# EAGLE design 612_jetracer_esp32s3_030003 (EAGLE 9.6.2)
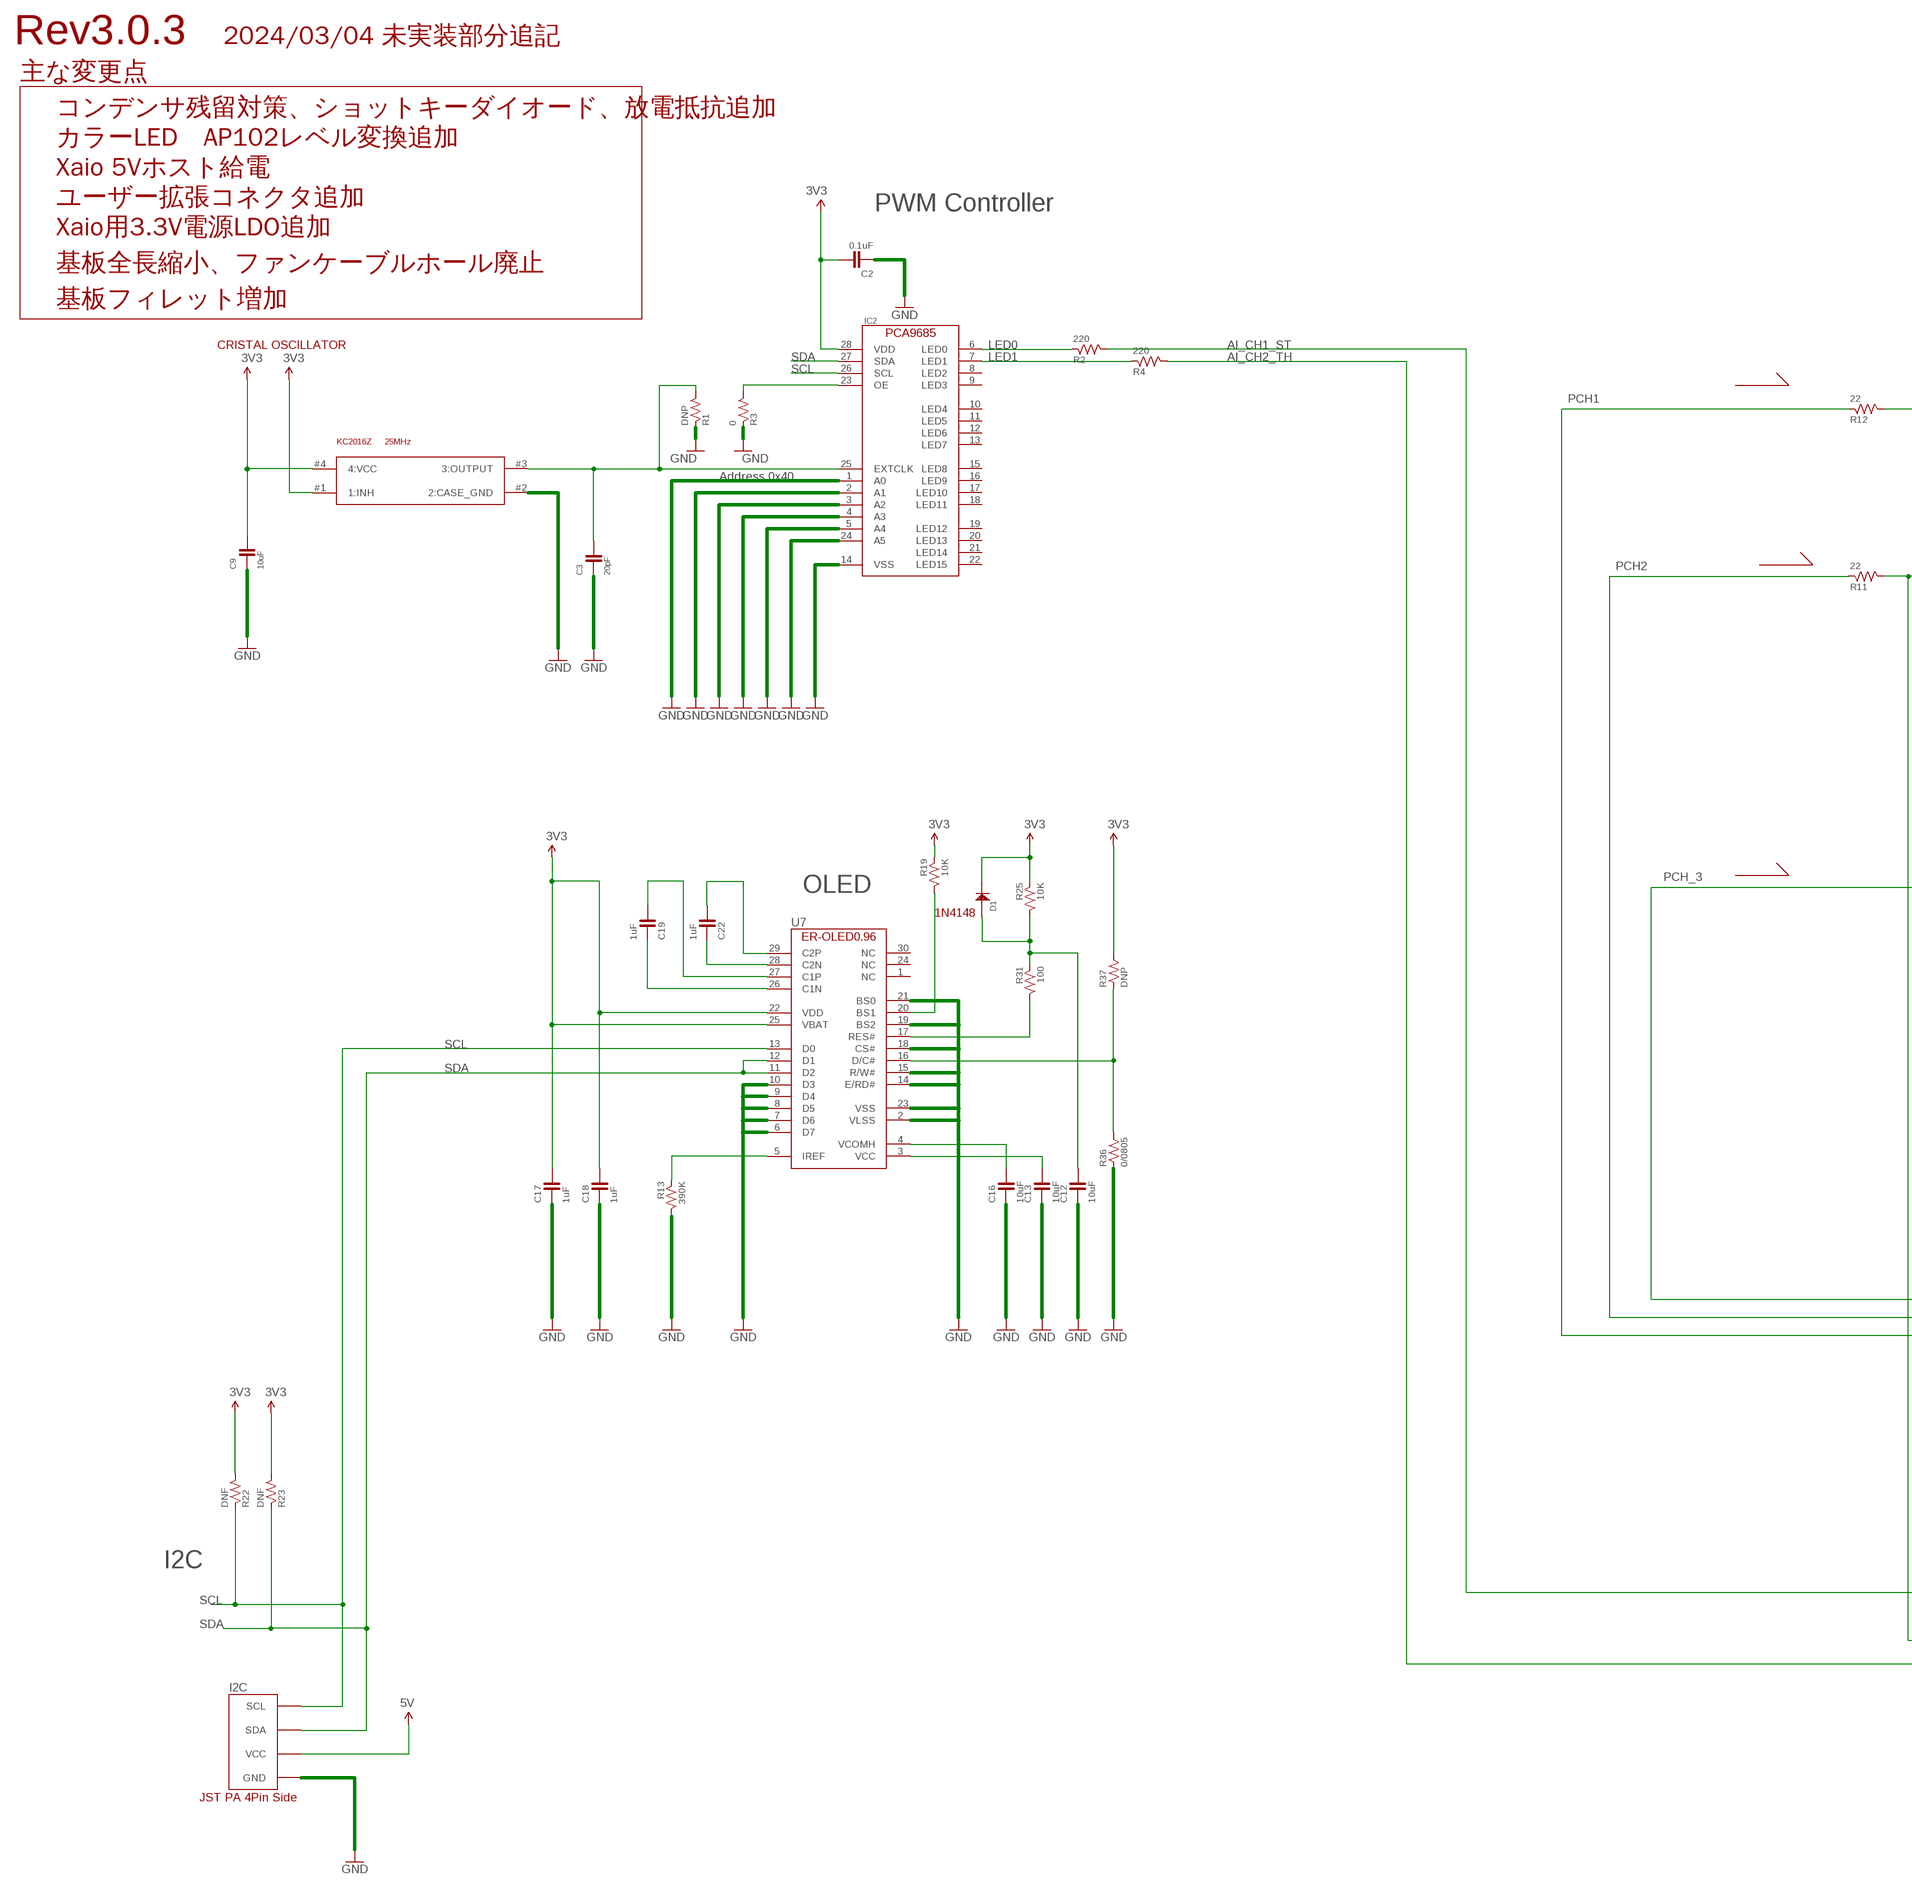
[diagram p0: schematic, sheet 1, part 1 of 3]
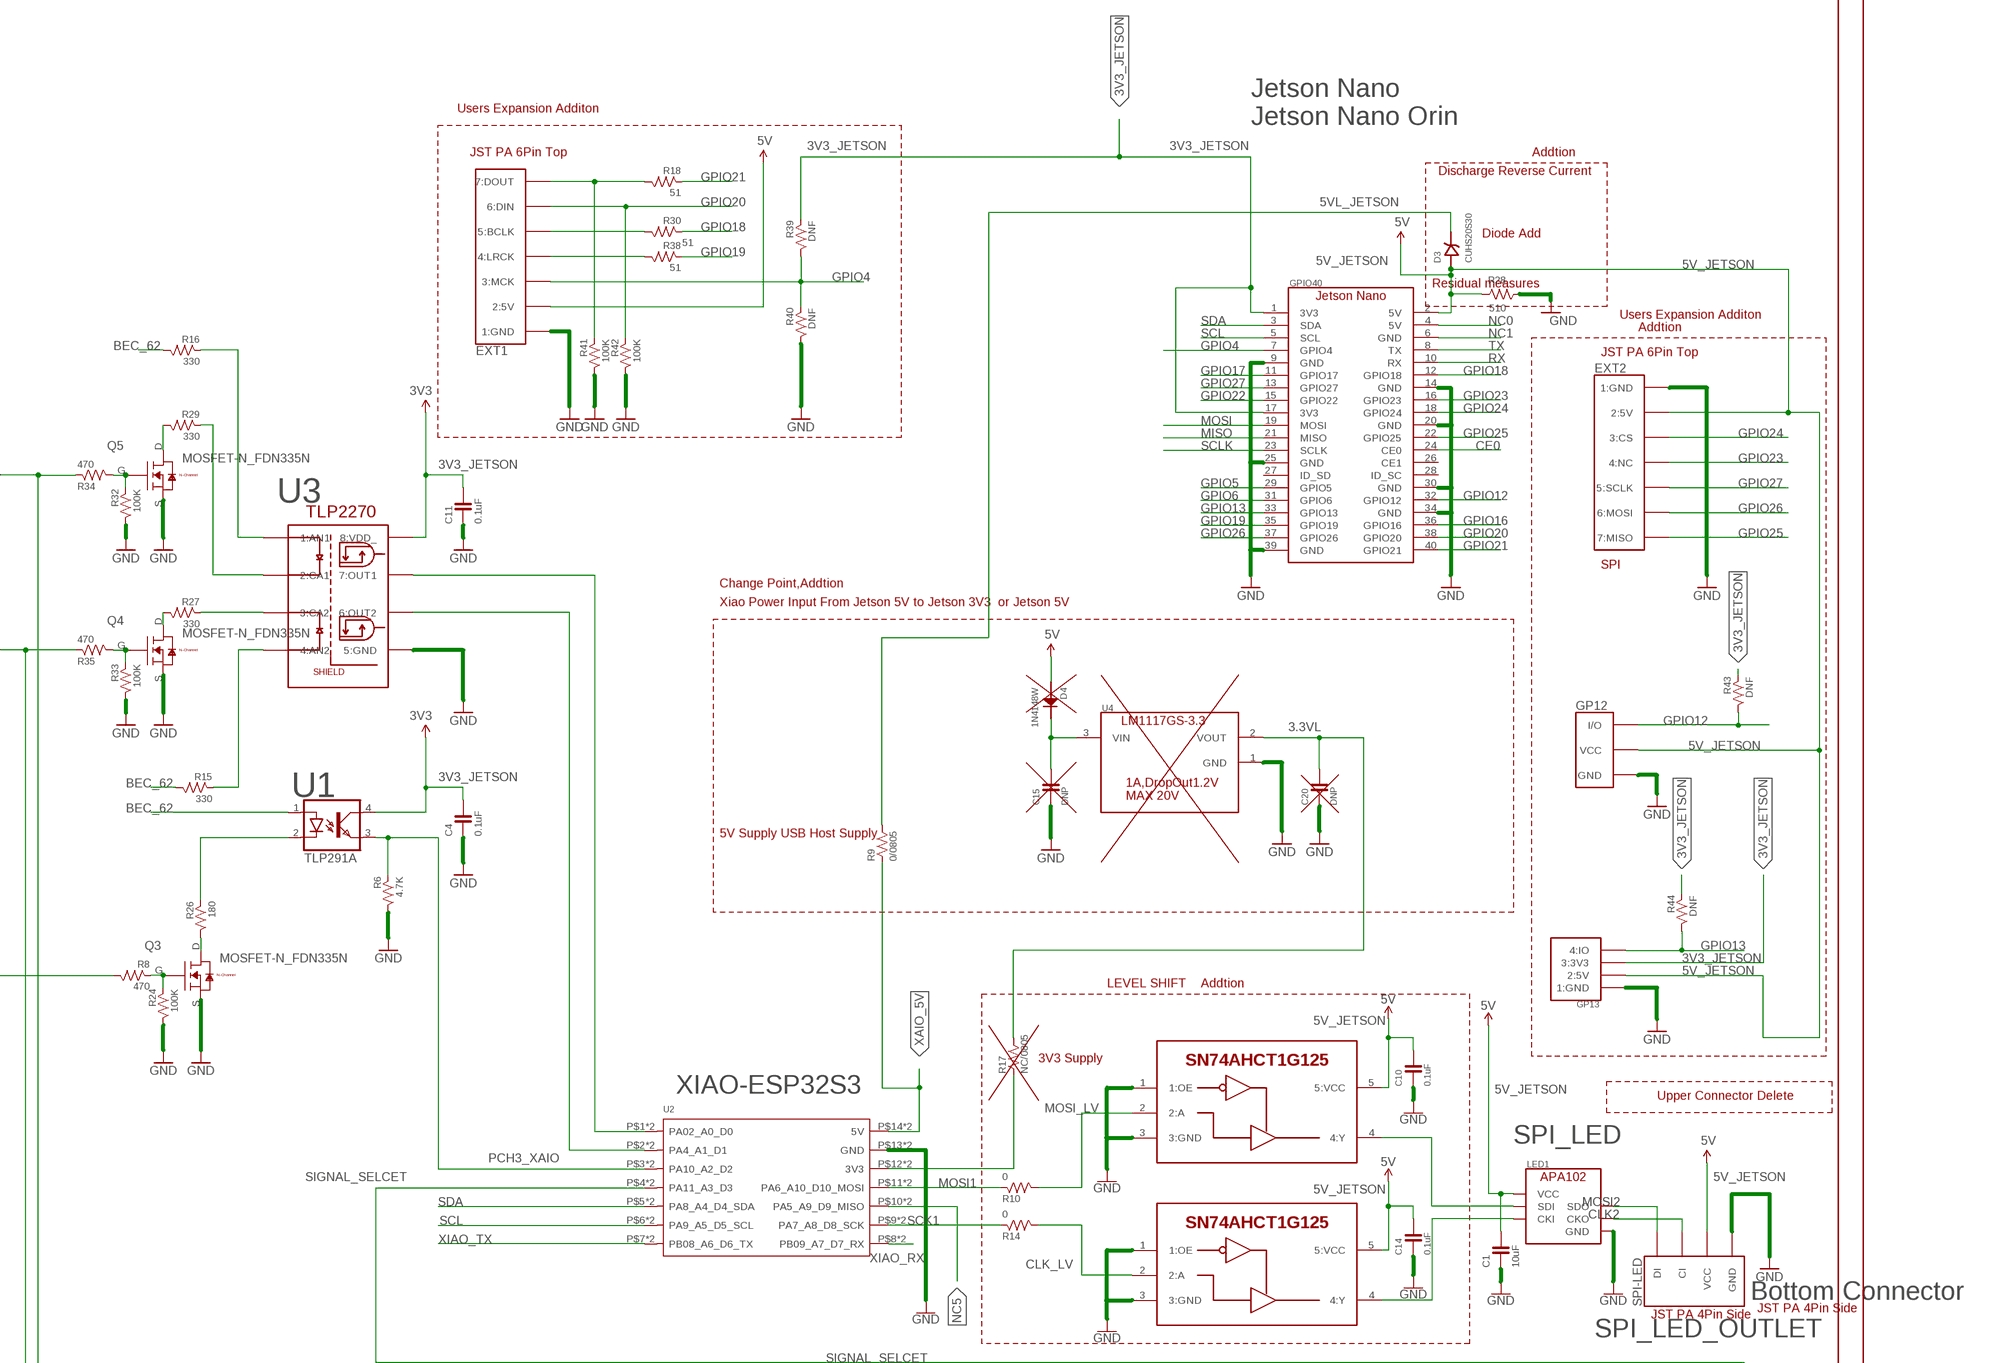
[diagram p1: schematic, sheet 1, part 2 of 3]
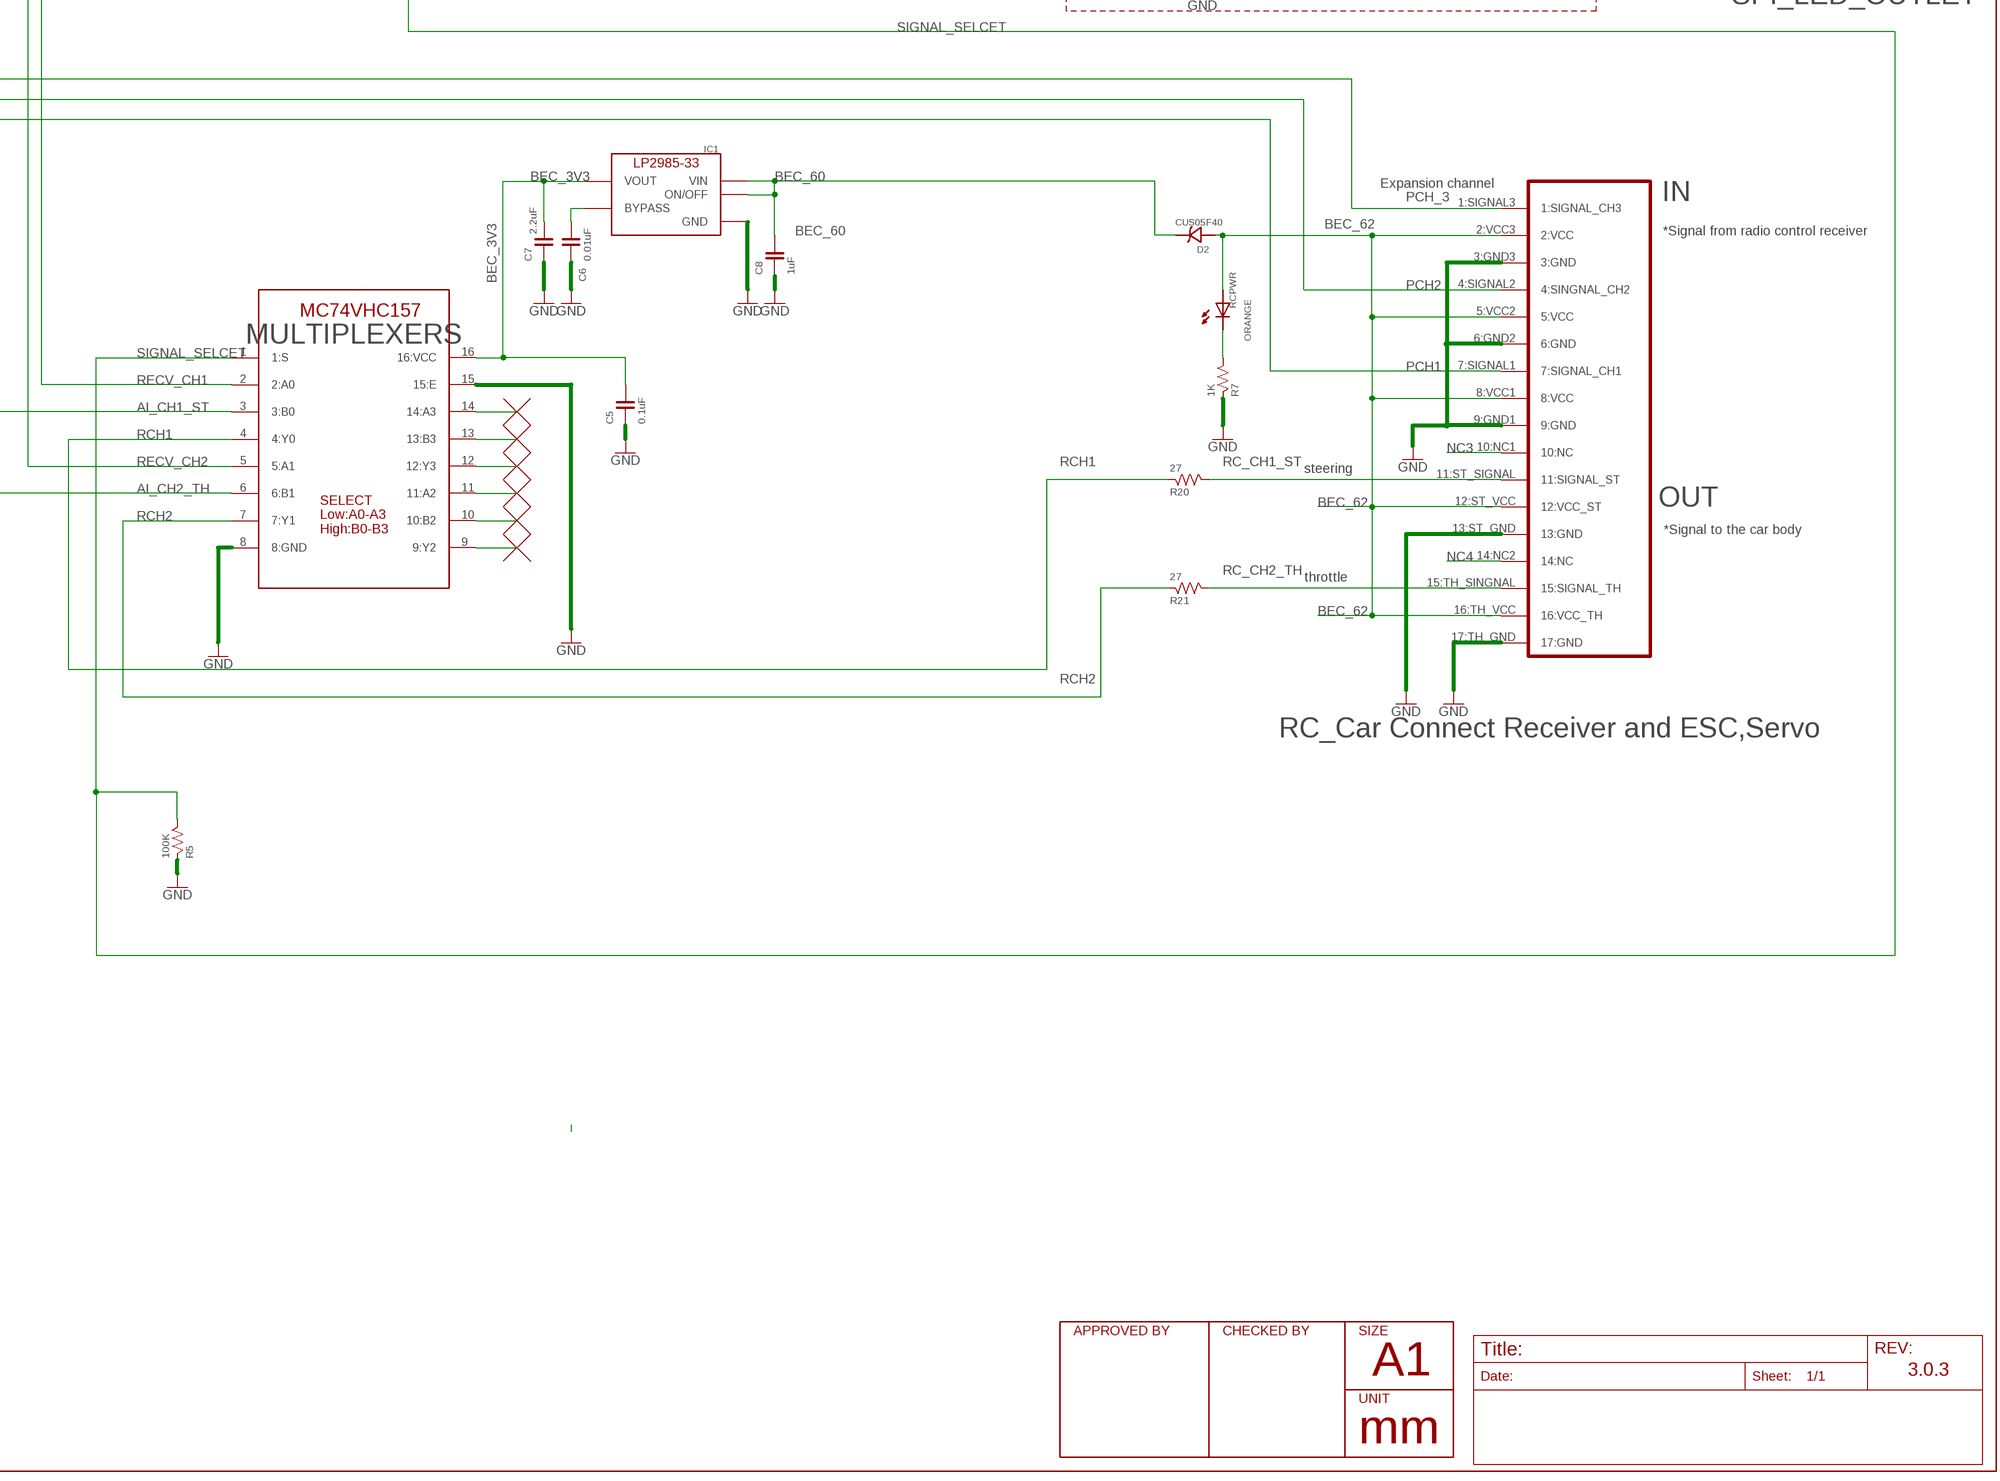
[diagram p2: schematic, sheet 1, part 3 of 3]

## Parts
C1  10uF  CAPACITOR-0603  [0603]
C2  0.1uF  CAPACITOR-0603  [0603]
C3  20pF  CAPACITOR-0402  [0402]
C4  0.1uF  CAPACITOR-0603  [0603]
C5  0.1uF  CAPACITOR-0603  [0603]
C6  0.01uF  CAPACITOR-0603  [0603]
C7  2.2uF  CAPACITOR-0603  [0603]
C8  1uF  CAPACITOR-0603  [0603]
C9  10uF  CAPACITOR-0402  [0402]
C10  0.1uF  CAPACITOR-0402  [0402]
C11  0.1uF  CAPACITOR-0603  [0603]
C12  10uF  CAPACITOR-0603  [0603]
C13  10uF  CAPACITOR-0603  [0603]
C14  0.1uF  CAPACITOR-0402  [0402]
C15  DNP  CAPACITOR-0402  [0402]
C16  10uF  CAPACITOR-0603  [0603]
C17  1uF  CAPACITOR-0603  [0603]
C18  1uF  CAPACITOR-0603  [0603]
C19  1uF  CAPACITOR-0603  [0603]
C20  DNP  CAPACITOR-0402  [0402]
C22  1uF  CAPACITOR-0603  [0603]
D1  1N4148  [1N4148W]
D2  CUS05F40  [CUS05F40]
D3  CUHS20S30  [US2H]
D4  1N4148W  [SOD-123]
EXT1  FABO-I2S-7PIN  [SPI-B07B-PASK-1]
EXT2  FABO-SPI-7PIN  [SPI-B07B-PASK-1]
GP12  FABO_BRICK_3PIN-B03B-PASK-1  [FABO_BRICK_3PIN_B03B-PASK-1]
GP13  FABO-GPIO-2G  [GPIO-B04B-PASK-1]
GPIO40  JETSON_NANOJETSON_NANO_OVERALL  [JETSON_NANO_DEMENTION]
I2C  FABO-I2C  [I2C-SM04B-PASS-1-FL]
IC1  LP2985-33DBVR  [SOT-23-5]
IC2  PCA9685PW,BS  [PCA9685]
LED1  APA102_IPIXEL  [APA102_2020]
Q3  MOSFET-N_FDN335N  [SUPERSOT-3]
Q4  MOSFET-N_FDN335N  [SUPERSOT-3]
Q5  MOSFET-N_FDN335N  [SUPERSOT-3]
R1  DNP  RESISTOR-0603  [0603]
R2  220  RESISTOR-0603  [0603]
R3  0  RESISTOR-0603  [0603]
R4  220  RESISTOR-0603  [0603]
R5  100K  RESISTOR-0603  [0603]
R6  4.7K  RESISTOR-0603  [0603]
R7  1K  RESISTOR-0603  [0603]
R8  470  RESISTOR-0603  [0603]
R9  0/0805  RESISTOR-0805  [0805]
R10  0  RESISTOR-0603  [0603]
R11  22  RESISTOR-0603  [0603]
R12  22  RESISTOR-0603  [0603]
R13  390K  RESISTOR-0603  [0603]
R14  0  RESISTOR-0603  [0603]
R15  330  RESISTOR-0603  [0603]
R16  330  RESISTOR-0603  [0603]
R17  NC/0805  RESISTOR-0805  [0805]
R18  51  RESISTOR-0603  [0603]
R19  10K  RESISTOR-0603  [0603]
R20  27  RESISTOR-0603  [0603]
R21  27  RESISTOR-0603  [0603]
R22  DNF  RESISTOR-0603  [0603]
R23  DNF  RESISTOR-0603  [0603]
R24  100K  RESISTOR-0603  [0603]
R25  10K  RESISTOR-0603  [0603]
R26  180  RESISTOR-0603  [0603]
R27  330  RESISTOR-0603  [0603]
R28  510  RESISTOR-0805  [0805]
R29  330  RESISTOR-0603  [0603]
R30  51  RESISTOR-0603  [0603]
R31  100  RESISTOR-0603  [0603]
R32  100K  RESISTOR-0603  [0603]
R33  100K  RESISTOR-0603  [0603]
R34  470  RESISTOR-0603  [0603]
R35  470  RESISTOR-0603  [0603]
R36  0/0805  RESISTOR-0805  [0805]
R37  DNP  RESISTOR-0805  [0805]
R38  51  RESISTOR-0603  [0603]
R39  DNF  RESISTOR-0603  [0603]
R40  DNF  RESISTOR-0603  [0603]
R41  100K  RESISTOR-0603  [0603]
R42  100K  RESISTOR-0603  [0603]
R43  DNF  RESISTOR-0603  [0603]
R44  DNF  RESISTOR-0603  [0603]
RCPWR  ORANGE  LED-0603  [0603]
SPI-LED  FABO-SPI-LED  [SPI-SM04B-PASS-1-FL]
U1  TLP291A  [11-3C1]
U2  MOUDLE-SEEEDUINO-XIAO-ESP32C3  [MOUDLE14P-DIP]
U3  TLP2270  [TLP2270]
U4  LM1117GS-3.3  [SOT-223-3]
U7  ER-OLED0.96-1ER-CON30HT-1  [ER-CON30HT-1]
U$1  RC_17PIN_OUTIN  [PNHEADER_2.54_SMT_17PIN_RC_TT01_02]
U$3  MC74VHC157  [MC74VHC157_TSSOP-16]
U$9  SN74AHCT1G125  [SOT-1DOT1]
U$10  SN74AHCT1G125  [SOT-1DOT1]
U$11  KC2016Z  [KC2016Z]

## Nets
3.3VL: C20.2 R17.2 U4.2(VOUT)
3V3_JETSON: C2.2 C4.2 C9.2 C11.2 C17.2 C18.2 D1.CATHODE GP13.3V3(3:3V3) GPIO40.1(3V3) GPIO40.17(3V3) IC2.28(VDD) R19.1 R22.2 R23.2 R25.1 R37.2 R39.1 R43.1 R44.1 U1.4(COL) U3.8(8:VDD_) U7.22(VDD) U7.25(VBAT) U$11.#1(1:INH) U$11.#4(4:VCC) ; supply symbol labelled 3V3
3VLL: R17.1 U2.P$12(3V3) U2.P$26(3V3)
5V_JETSON: C1.2 C10.2 C14.2 D3.A(ANODE) D4.2(ANODE) EXT1.2(2:5V) EXT2.2(2:5V) GP12.VCC GP13.5V(2:5V) GPIO40.2(5V) I2C.5V(VCC) LED1.VCC R28.2 SPI-LED.5V(VCC) U$9.5(5:VCC) U$10.5(5:VCC) ; supply symbol labelled 5V
5VL_JETSON: D3.K(CATHODE) R9.2
AI_CH1_ST: R2.2 U$3.3(3:B0)
AI_CH2_TH: R4.2 U$3.6(6:B1)
BEC_3V3: C5.2 C7.2 IC1.5(VOUT) U$3.16(16:VCC)
BEC_60: C8.2 D2.C(CATHODE) IC1.1(VIN) IC1.3(ON/OFF)
BEC_62: D2.A(ANODE) R15.2 R16.2 RCPWR.ANODE U1.1(A) U$1.2:VCC3(2:VCC) U$1.5:VCC2(5:VCC) U$1.8:VCC1(8:VCC) U$1.12:ST_VCC(12:VCC_ST) U$1.16:TH_VCC(16:VCC_TH)
CE0: GPIO40.24(CE0)
CLK2: LED1.CKO SPI-LED.CI
CLK_HV: LED1.CKI U$10.4(4:Y)
CLK_LV: R14.2 U$10.2(2:A)
G18: EXT1.5(5:BCLK) R30.2
G19: EXT1.4(4:LRCK) R38.2
G21: EXT1.7(7:DOUT) R18.2 R41.1
GND: C1.1 C2.1 C3.1 C4.1 C5.1 C6.1 C7.1 C8.1 C9.1 C10.1 C11.1 C12.1 C13.1 C14.1 C15.1 C16.1 C17.1 C18.1 C20.1 EXT1.1(1:GND) EXT2.1(1:GND) GP12.GND GP13.GND(1:GND) GPIO40.9(GND) GPIO40.14(GND) GPIO40.20(GND) GPIO40.25(GND) GPIO40.30(GND) GPIO40.34(GND) GPIO40.39(GND) I2C.GND IC1.2(GND) IC2.1(A0) IC2.2(A1) IC2.3(A2) IC2.4(A3) IC2.5(A4) IC2.14(VSS) IC2.24(A5) LED1.GND Q3.S Q4.S Q5.S R1.1 R3.1 R5.1 R6.2 R7.1 R13.2 R24.2 R28.1 R32.2 R33.2 R36.1 R40.2 R41.2 R42.2 SPI-LED.GND U2.P$13(GND) U2.P$27(GND) U3.5(5:GND) U4.1(GND) U7.2(VLSS) U7.6(D7) U7.7(D6) U7.8(D5) U7.9(D4) U7.10(D3) U7.14(E/RD#) U7.15(R/W#) U7.18(CS#) U7.19(BS2) U7.21(BS0) U7.23(VSS) U$1.3:GND3(3:GND) U$1.6:GND2(6:GND) U$1.9:GND1(9:GND) U$1.13:ST_GND(13:GND) U$1.17:TH_GND(17:GND) U$3.8(8:GND) U$3.15(15:E) U$9.1(1:OE) U$9.3(3:GND) U$10.1(1:OE) U$10.3(3:GND) U$11.#2(2:CASE_GND)
GPIO4: EXT1.3(3:MCK) GPIO40.7(GPIO4) R39.2 R40.1
GPIO5: GPIO40.29(GPIO5)
GPIO6: GPIO40.31(GPIO6)
GPIO12: GP12.I/O GPIO40.32(GPIO12) R43.2
GPIO13: GP13.IO(4:IO) GPIO40.33(GPIO13) R44.2
GPIO16: GPIO40.36(GPIO16)
GPIO17: GPIO40.11(GPIO17)
GPIO18: GPIO40.12(GPIO18) R30.1
GPIO19: GPIO40.35(GPIO19) R38.1
GPIO20: EXT1.6(6:DIN) GPIO40.38(GPIO20) R42.1
GPIO21: GPIO40.40(GPIO21) R18.1
GPIO22: GPIO40.15(GPIO22)
GPIO23: EXT2.4(4:NC) GPIO40.16(GPIO23)
GPIO24: EXT2.3(3:CS) GPIO40.18(GPIO24)
GPIO25: EXT2.7(7:MISO) GPIO40.22(GPIO25)
GPIO26: EXT2.6(6:MOSI) GPIO40.37(GPIO26)
GPIO27: EXT2.5(5:SCLK) GPIO40.13(GPIO27)
LED0: IC2.6(LED0) R2.1
LED1: IC2.7(LED1) R4.1
MISO: GPIO40.21(MISO)
MOSI: GPIO40.19(MOSI)
MOSI1: R10.1 U2.P$11(PA6_A10_D10_MOSI) U2.P$25(PA6_A10_D10_MOSI)
MOSI2: LED1.SDO SPI-LED.DI
MOSI_HV: LED1.SDI U$9.4(4:Y)
MOSI_LV: R10.2 U$9.2(2:A)
N$2: U$3.9(9:Y2)
N$3: C22.2 U7.29(C2P)
N$4: U$3.10(10:B2)
N$5: U2.P$1(PA02_A0_D0) U2.P$15(PA02_A0_D0) U3.7(7:OUT1)
N$6: R26.1 U1.2(C)
N$7: IC2.23(OE) R3.2
N$8: U2.P$2(PA4_A1_D1) U2.P$16(PA4_A1_D1) U3.6(6:OUT2)
N$9: R15.1 U3.4(4:AN2)
N$10: C15.2 D4.1(CATHODE) U4.3(VIN)
N$12: R16.1 U3.1(1:AN1)
N$14: R13.1 U7.5(IREF)
N$16: C19.2 U7.27(C1P)
N$17: C13.2 U7.3(VCC)
N$18: R31.2 U7.17(RES#)
N$19: U$3.11(11:A2)
N$20: U$3.12(12:Y3)
N$21: C19.1 U7.26(C1N)
N$22: C22.1 U7.28(C2N)
N$23: Q3.G R8.1 R24.1
N$24: R7.2 RCPWR.CATHODE
N$25: C16.2 U7.4(VCOMH)
N$26: Q3.D R26.2
N$27: Q4.D R27.2
N$28: R27.1 U3.3(3:CA2)
N$29: Q5.D R29.2
N$30: R29.1 U3.2(2:CA1)
N$31: U$3.13(13:B3)
N$32: C12.2 D1.ANODE R25.2 R31.1
N$33: Q5.G R32.1 R34.2
N$35: U$3.14(14:A3)
N$37: R36.2 R37.1 U7.16(D/C#)
N$38: Q4.G R33.1 R35.2
N$40: C6.2 IC1.4(BYPASS)
N$41: C3.2 IC2.25(EXTCLK) R1.2 U$11.#3(3:OUTPUT)
N$50: R19.2 U7.20(BS1)
NC0: GPIO40.4(5V)
NC1: GPIO40.6(GND)
NC3: U$1.10:NC1(10:NC)
NC4: U$1.14:NC2(14:NC)
NC5: U2.P$10(PA5_A9_D9_MISO) U2.P$24(PA5_A9_D9_MISO)
PCH1: R12.1 U$1.7:SIGNAL1(7:SIGNAL_CH1)
PCH2: R11.1 U$1.4:SIGNAL2(4:SINGNAL_CH2)
PCH3_XAIO: R6.1 U1.3(EMI) U2.P$3(PA10_A2_D2) U2.P$17(PA10_A2_D2)
PCH_3: R8.2 U$1.1:SIGNAL3(1:SIGNAL_CH3)
RC_CH1_ST: R20.2 U$1.11:ST_SIGNAL(11:SIGNAL_ST)
RC_CH2_TH: R21.2 U$1.15:TH_SINGNAL(15:SIGNAL_TH)
RCH1: R20.1 U$3.4(4:Y0)
RCH2: R21.1 U$3.7(7:Y1)
RECV_CH1: R12.2 R34.1 U$3.2(2:A0)
RECV_CH2: R11.2 R35.1 U$3.5(5:A1)
RX: GPIO40.10(RX)
SCK1: R14.1 U2.P$9(PA7_A8_D8_SCK) U2.P$23(PA7_A8_D8_SCK)
SCL: GPIO40.5(SCL) I2C.SCL IC2.26(SCL) R22.1 U2.P$6(PA9_A5_D5_SCL) U2.P$20(PA9_A5_D5_SCL) U7.13(D0)
SCLK: GPIO40.23(SCLK)
SDA: GPIO40.3(SDA) I2C.SDA IC2.27(SDA) R23.1 U2.P$5(PA8_A4_D4_SDA) U2.P$19(PA8_A4_D4_SDA) U7.11(D2) U7.12(D1)
SIGNAL_SELCET: R5.2 U2.P$4(PA11_A3_D3) U2.P$18(PA11_A3_D3) U$3.1(1:S)
TX: GPIO40.8(TX)
XAIO_5V: R9.1 U2.P$14(5V) U2.P$28(5V)
XIAO_RX: U2.P$8(PB09_A7_D7_RX) U2.P$22(PB09_A7_D7_RX)
XIAO_TX: U2.P$7(PB08_A6_D6_TX) U2.P$21(PB08_A6_D6_TX)
Unconnected: GPIO40.26(CE1) GPIO40.27(ID_SD) GPIO40.28(ID_SC) IC2.8(LED2) IC2.9(LED3) IC2.10(LED4) IC2.11(LED5) IC2.12(LED6) IC2.13(LED7) IC2.15(LED8) IC2.16(LED9) IC2.17(LED10) IC2.18(LED11) IC2.19(LED12) IC2.20(LED13) IC2.21(LED14) IC2.22(LED15) U7.1(NC) U7.24(NC) U7.30(NC)

## Notes on the sheet
- Rev3.0.3 | 2024/03/04 未実装部分追記
- Users Expansion Additon
- Jetson Nano
  Jetson Nano Orin
- 主な変更点
- JST PA 6Pin Top | Addtion
- コンデンサ残留対策、ショットキーダイオード、放電抵抗追加
- Discharge Reverse Current
- カラーLED　AP102レベル変換追加
- Xaio 5Vホスト給電
- Diode Add
- ユーザー拡張コネクタ追加 | PWM Controller
- Residual measures
- Xaio用3.3V電源LDO追加
- Users Expansion Additon
- 基板全長縮小、ファンケーブルホール廃止 | Addtion
- JST PA 6Pin Top
- 基板フィレット増加
- CRISTAL OSCILLATOR
- Address 0x40
- SPI
- Change Point,Addtion
- Xiao Power Input From Jetson 5V to Jetson 3V3  or Jetson 5V
- 5V Supply USB Host Supply
- OLED
- LEVEL SHIFT | Addtion
- 1N4148
- 3V3 Supply
- XIAO-ESP32S3
- Upper Connector Delete
- SPI_LED
- Bottom Connector
- JST PA 4Pin Side
- JST PA 4Pin Side
- SPI_LED_OUTLET
- Expansion channel
- IN
- *Signal from radio control receiver
- MULTIPLEXERS
- I2C
- steering
- OUT
- *Signal to the car body
- SELECT
  Low:A0-A3
  High:B0-B3
- throttle
- JST PA 4Pin Side
- RC_Car Connect Receiver and ESC,Servo
- 3.0.3

## Library data of the parts
C1-C20 C22 = FaBo-Capacitor:CAPACITOR: CAPACITOR
D1 = FaBo-Diode:1N4148
D2 = FaBo-Diode:CUS05F40
D3 = FaBo-Diode:CUHS20S30: 30V,2A,temp-50~150,if 0.25V(0.5A),rev 170uA(10V)
D4 = FaBo-Diode:1N4148W
EXT1 = FaBo-Connetor:FABO-I2S-7PIN
EXT2 = FaBo-Connetor:FABO-SPI-7PIN
GP12 = FaBo-Template:FABO_BRICK_3PIN: FaBo Brick 3pin
GP13 = FaBo-Connetor:FABO-GPIO-2G
GPIO40 = FaBo-Boards:JETSON_NANO
I2C = FaBo-Connetor:FABO-I2C
IC1 = FaBo-Supply:LP2985-33DBVR: LP2985
IC2 = FaBo-Motor:PCA9685PW,BS
LED1 = FaBo-LED:APA102
Q3-Q5 = FaBo-Mosfet:MOSFET-N
R1-R36 R38-R44 = FaBo-Resistors:RESISTOR: RESISTOR
R37 = FaBo-Resistors:RESISTOR: RESISTOR; SPICEPREFIX: R
RCPWR = FaBo-LED:LED
SPI-LED = FaBo-Connetor:FABO-SPI-LED
U1 = FaBo_Photocoupler:TLP291A
U2 = FaBo-MPU:MOUDLE-SEEEDUINO-XIAO-ESP32C3
U3 = FaBo-Photocoupler:TLP2270
U4 = FaBo-Supply:LM1117GS-3.3
U7 = FaBo-Display:ER-OLED0.96-1: ER-CON30HT-1 Rev2 wide distance 0.23mm
U$1 = FaBo-PIN:RC_17PIN_OUTIN
U$3 = FaBo-Multiplexers:MC74VHC157
U$9 U$10 = FaBo-LogicIC:SN74AHCT1G125: Input TTL logic level level shift
U$11 = FaBo-Crystal:KC2016Z

## Board
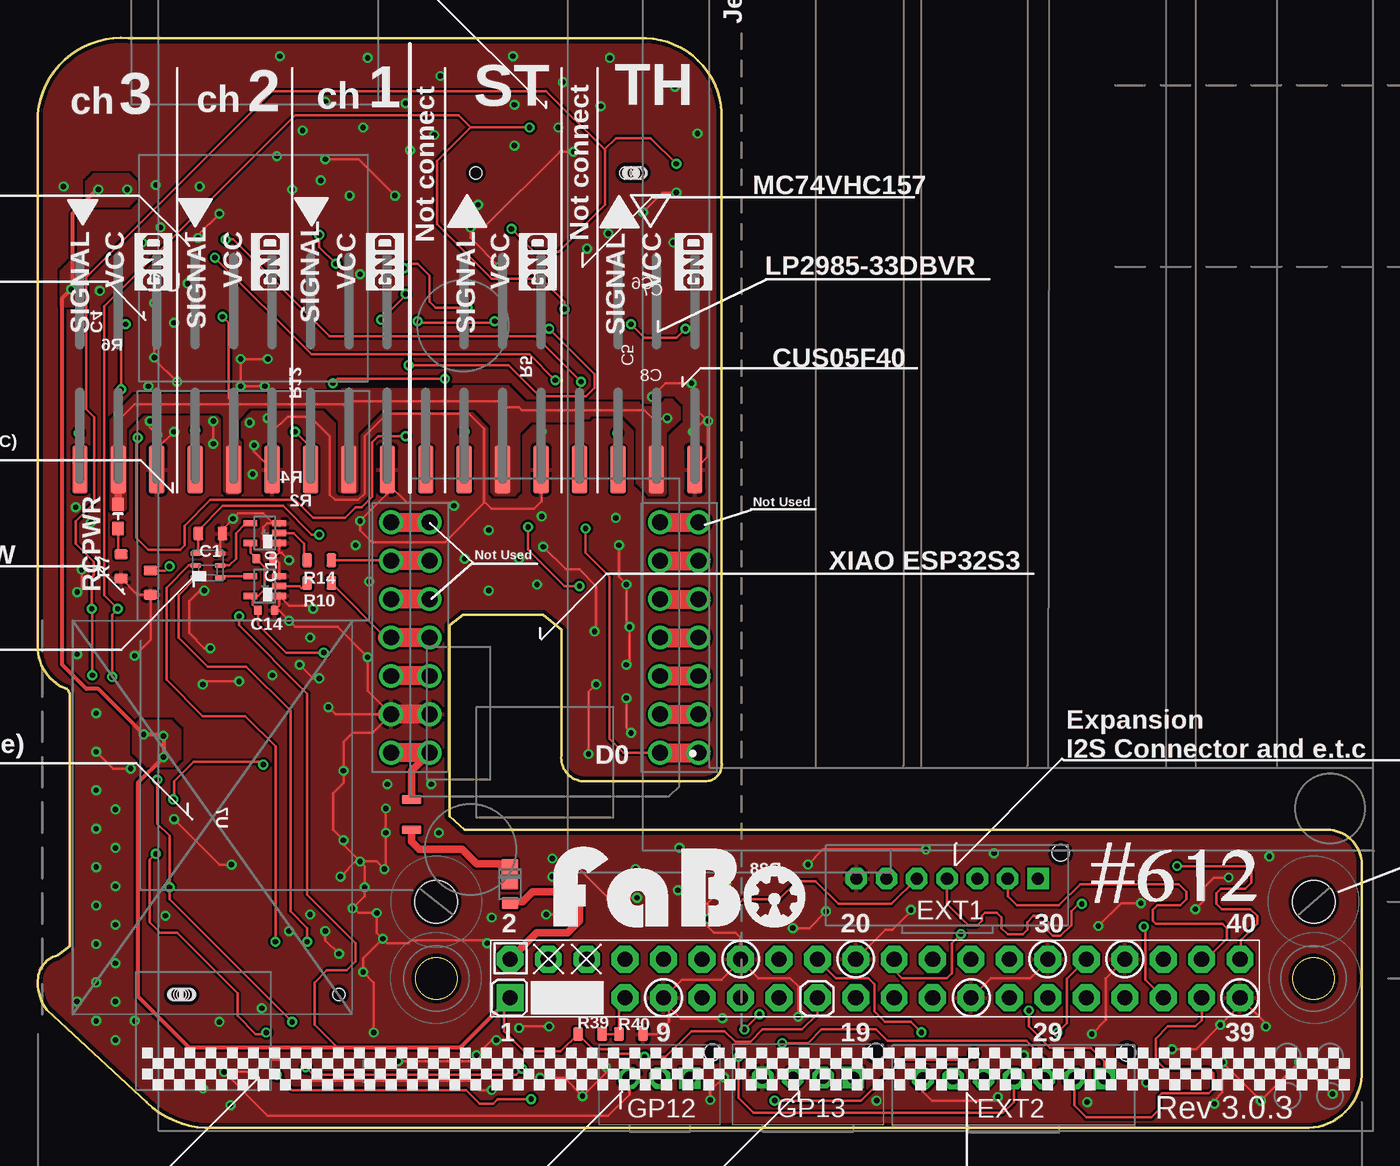
[diagram p3: board, top side]
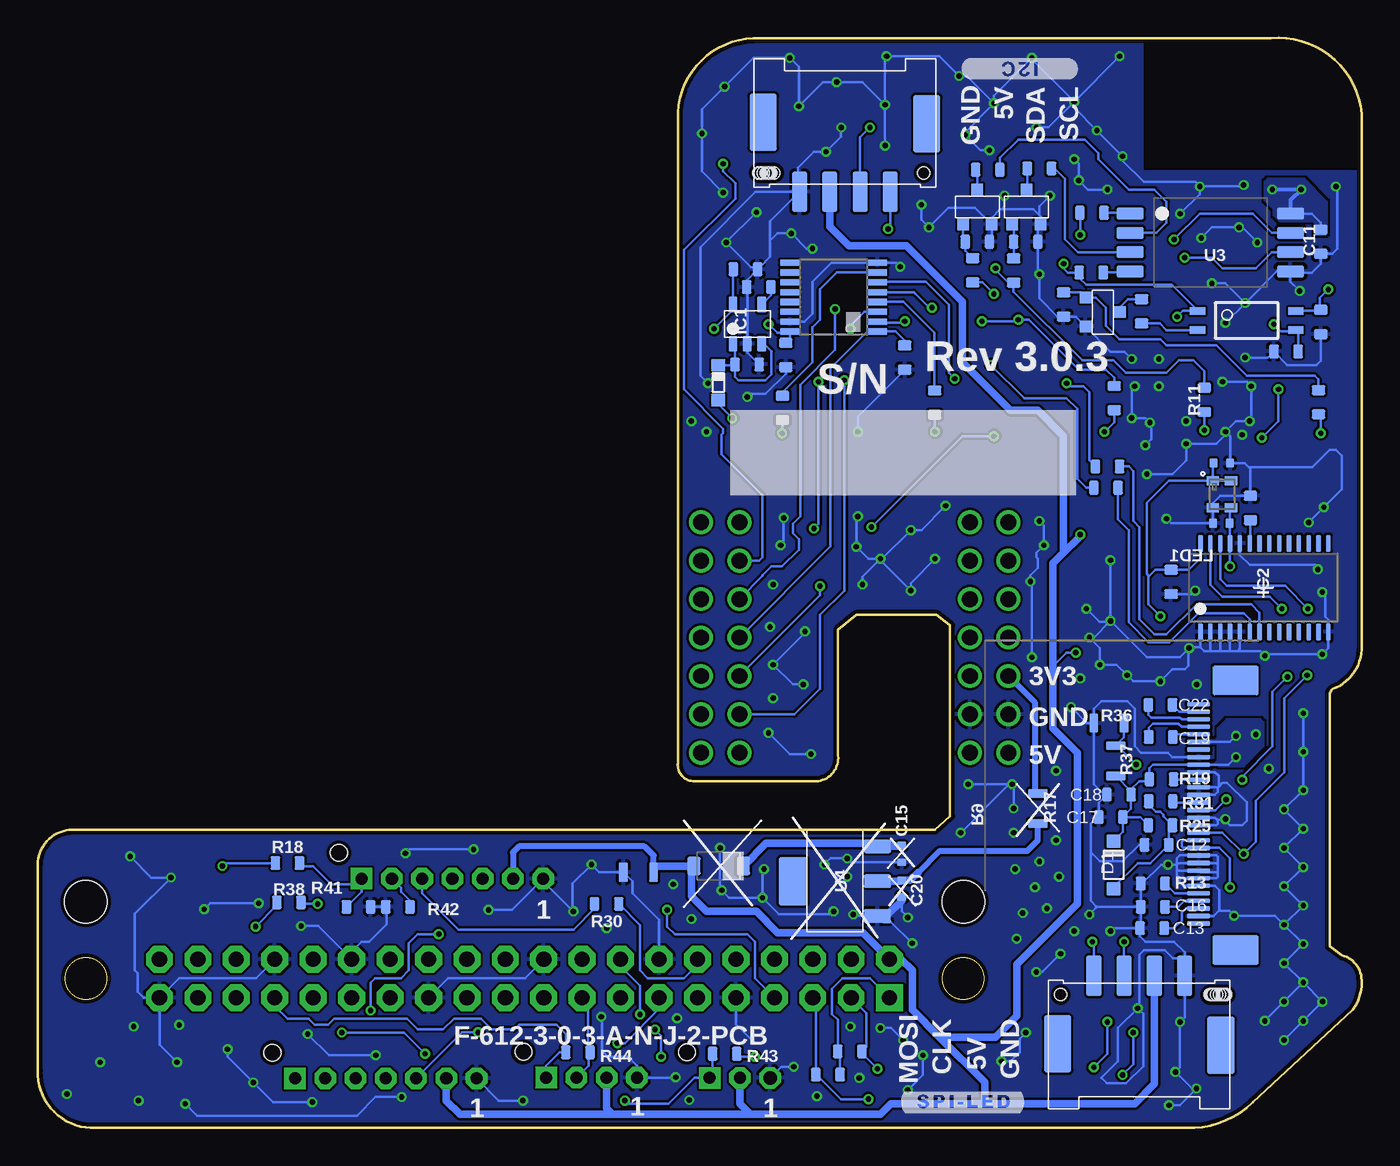
[diagram p4: board, bottom side, seen from below]

Size 87.5 x 72.02 mm. Coordinates in mm from the lower left corner, seen from the top.
Outline: 45.2,24.1 45.2,67.1 arc84 40.2,72 6,72 arc90 0,67 0,31.6 arc67 1.9,29 2,28.9 2.1,28.7 2.1,12 1.3,11.4 arc80 0,9.6 arc39 0.6,7.8 7.2,1.7 arc48 11.6,0 84,0 arc90 87.5,3.8 87.5,17.4 arc90 85.2,19.7 28.2,19.7 27.2,20.6 27.2,33.2 28.1,33.9 33.4,33.9 34.6,32.9 34.6,24.6 arc99 36.2,22.9 44.1,22.9 arc95 45.2,24.1
Copper layers (1*16): Top 0.035mm / dielectric 1.6mm / Bottom 0.035mm
Design rules "PCBway": minimum track width 6mil, minimum drill 12mil, track to track 6mil, track to pad 6mil, pad to pad 6mil, via to via 6mil, smd to smd 6mil, copper to edge 10mil, drill to drill 10mil, minimum pad ring 10mil, minimum via ring 6mil, stop-mask expansion 2mil, vias tented up to drill 100mil, thermal gap 8mil
Holes 2.8 mm at 84.33,14.95 26.33,14.94
bRestrict: area -0.3,63.3 to 14.4,85.7; 7 lines

### Footprints (pad centres in the part's own frame; a part is rotated, then mirrored left to right if it is on the bottom)
0603 = smd 0.65 x 0.9: 1 -0.8,0; 2 0.8,0
0402 = smd 0.5 x 0.6: 1 -0.55,0; 2 0.55,0
1N4148W = smd 0.9 x 0.95: ANODE 0,0; CATHODE 3.15,0
CUS05F40 = smd 0.8 x 0.9: A -1.15,0; C 1.15,0
US2H = smd 0.8 x 1.1: A 1.25,0 | smd 2 x 1.1: K -0.65,0
SOD-123 = smd 0.91 x 1.22: 1 -1.635,0; 2 1.635,0
SPI-B07B-PASK-1 = drill 0.8 pad 1.422 octagon: 1 -6,1.27; 2 -4,1.27; 3 -2,1.27; 4 0,1.27; 5 2,1.27; 6 4,1.27 | drill 0.8 pad 1.422 square: 7 6,1.27 | hole 1.1: 7.5,2.97
FABO_BRICK_3PIN_B03B-PASK-1 = drill 0.9 pad 1.422 octagon: GND -2,0 | drill 0.8 pad 1.422 square: I/O 2,0 | drill 0.8 pad 1.422 octagon: VCC 0,0 | hole 1.1: 3.5,1.7
GPIO-B04B-PASK-1 = drill 0.8 pad 1.422 octagon: 3V3 1,0.02; 5V -1,0.02; GND -3,0.02 | drill 0.8 pad 1.422 square: IO 3,0.02 | hole 1.1: 4.5,1.72
JETSON_NANO_DEMENTION = drill 1 pad 1.778 square: 1 0,0 | drill 1 pad 1.778 octagon: 2 0,2.54; 3 2.54,0; 4 2.54,2.54; 5 5.08,0; 6 5.08,2.54; 7 7.62,0; 8 7.62,2.54; 9 10.16,0; 10 10.16,2.54; 11 12.7,0; 12 12.7,2.54; 13 15.24,0; 14 15.24,2.54; 15 17.78,0; 16 17.78,2.54; 17 20.32,0; 18 20.32,2.54; 19 22.86,0; 20 22.86,2.54; 21 25.4,0; 22 25.4,2.54; 23 27.94,0; 24 27.94,2.54; 25 30.48,0; 26 30.48,2.54; 27 33.02,0; 28 33.02,2.54; 29 35.56,0; 30 35.56,2.54; 31 38.1,0; 32 38.1,2.54; 33 40.64,0; 34 40.64,2.54; 35 43.18,0; 36 43.18,2.54; 37 45.72,0; 38 45.72,2.54; 39 48.26,0; 40 48.26,2.54
I2C-SM04B-PASS-1-FL = smd 1 x 2.7: 5V -1,0; GND -3,0; SCL 3,0; SDA 1,0 | smd 1.8 x 3.8: P$5 -5.4,4.6; P$6 5.4,4.5 | hole 0.8: 5.2,1.25; -4.7,1.25; -5.7,1.25; -5.6,1.25; -5.4,1.25; -5.2,1.25; -5.1,1.25; -5,1.25; -4.9,1.25
SOT-23-5 = smd 0.6 x 1.05: 1 -0.95,-1.3; 2 0,-1.3; 3 0.95,-1.3; 4 0.95,1.3; 5 -0.95,1.3
PCA9685 = smd 0.3 x 1.1: 1 -4.15,-2.93; 2 -3.5,-2.93; 3 -2.85,-2.93; 4 -2.2,-2.93; 5 -1.55,-2.93; 6 -0.9,-2.93; 7 -0.25,-2.93; 8 0.4,-2.93; 9 1.05,-2.93; 10 1.7,-2.93; 11 2.35,-2.93; 12 3,-2.93; 13 3.65,-2.93; 14 4.3,-2.93; 15 4.3,2.92; 16 3.65,2.92; 17 3,2.92; 18 2.35,2.92; 19 1.7,2.92; 20 1.05,2.92; 21 0.4,2.92; 22 -0.25,2.92; 23 -0.9,2.92; 24 -1.55,2.92; 25 -2.2,2.92; 26 -2.85,2.92; 27 -3.5,2.92; 28 -4.15,2.92
APA102_2020 = smd 0.7 x 0.35: CKI 0.8,0; CKO -0.8,0; GND 0.8,0.8; SDI 0.8,-0.8; SDO -0.8,-0.8; VCC -0.8,0.8
SUPERSOT-3 = smd 0.76 x 0.76: D 0,1.15; G -0.95,-1.15; S 0.95,-1.15
0805 = smd 0.6 x 1.3: 1 -1,0; 2 1,0
0603' = smd 0.9 x 0.8: ANODE -0.8,0; CATHODE 0.8,0
SPI-SM04B-PASS-1-FL = smd 1 x 2.7: 5V -1,-0.1; CI 1,-0.1; DI 3,-0.1; GND -3,-0.1 | smd 1.8 x 3.8: P$5 -5.4,4.5; P$6 5.4,4.4 | hole 0.8: 5.2,1.15; -4.7,1.15; -5.7,1.15; -4.8,1.15; -4.9,1.15; -5.1,1.15; -5.3,1.15; -5.5,1.15; -5.6,1.15
11-3C1 = smd 1 x 0.5: 1 -3.24,0.635; 2 -3.24,-0.635; 3 3.24,-0.635; 4 3.24,0.635
MOUDLE14P-DIP = drill 1.05: P$1 1.27,18.12; P$2 1.27,15.58; P$3 1.27,13.04; P$4 1.27,10.5; P$5 1.27,7.96; P$6 1.27,5.42; P$7 1.27,2.88; P$8 16.51,2.88; P$9 16.51,5.42; P$10 16.51,7.96; P$11 16.51,10.5; P$12 16.51,13.04; P$13 16.51,15.58; P$14 16.51,18.12; P$15 -1.27,18.12; P$16 -1.27,15.58; P$17 -1.27,13.04; P$18 -1.27,10.5; P$19 -1.27,7.96; P$20 -1.27,5.42; P$21 -1.27,2.88; P$22 19.05,2.88; P$23 19.05,5.42; P$24 19.05,7.96; P$25 19.05,10.5; P$26 19.05,13.04; P$27 19.05,15.58; P$28 19.05,18.12
TLP2270 = smd 0.8 x 1.8: 1 -1.905,-5.3; 2 -0.635,-5.3; 3 0.635,-5.3; 4 1.905,-5.3; 5 1.905,5.3; 6 0.635,5.3; 7 -0.635,5.3; 8 -1.905,5.3
SOT-223-3 = smd 0.9 x 1.8: 1 -2.3,-2.8; 2 0,-2.8; 3 2.3,-2.8 | smd 3.2 x 1.9: 4 0,2.8
ER-CON30HT-1 = smd 0.3 x 1.5 bottom: 1 7,-0.23; 2 6.5,-0.23; 3 6,-0.23; 4 5.5,-0.23; 5 5,-0.23; 6 4.5,-0.23; 7 4,-0.23; 8 3.5,-0.23; 9 3,-0.23; 10 2.5,-0.23; 11 2,-0.23; 12 1.5,-0.23; 13 1,-0.23; 14 0.5,-0.23; 15 0,-0.23; 16 -0.5,-0.23; 17 -1,-0.23; 18 -1.5,-0.23; 19 -2,-0.23; 20 -2.5,-0.23; 21 -3,-0.23; 22 -3.5,-0.23; 23 -4,-0.23; 24 -4.5,-0.23; 25 -5,-0.23; 26 -5.5,-0.23; 27 -6,-0.23; 28 -6.5,-0.23; 29 -7,-0.23; 30 -7.5,-0.23 | smd 2 x 3 bottom: 31 -9.07,-2.67; 32 8.74,-2.67
PNHEADER_2.54_SMT_17PIN_RC_TT01_02 = smd 1.02 x 3.17: 1:SIGNAL3 -20.32,0; 2:VCC3 -17.78,0; 3:GND3 -15.24,0; 4:SIGNAL2 -12.7,0; 5:VCC2 -10.16,0; 6:GND2 -7.62,0; 7:SIGNAL1 -5.08,0; 8:VCC1 -2.54,0; 9:GND1 0,0; 10:NC1 2.54,0; 11:ST_SIGNAL 5.08,0; 12:ST_VCC 7.62,0; 13:ST_GND 10.16,0; 14:NC2 12.7,0; 15:TH_SINGNAL 15.24,0; 16:TH_VCC 17.78,0; 17:TH_GND 20.32,0
MC74VHC157_TSSOP-16 = smd 1.26 x 0.36: 1 -2.9,2.275; 2 -2.9,1.625; 3 -2.9,0.975; 4 -2.9,0.325; 5 -2.9,-0.325; 6 -2.9,-0.975; 7 -2.9,-1.625; 8 -2.9,-2.275; 9 2.9,-2.275; 10 2.9,-1.625; 11 2.9,-0.975; 12 2.9,-0.325; 13 2.9,0.325; 14 2.9,0.975; 15 2.9,1.625; 16 2.9,2.275
SOT-1DOT1 = smd 0.4 x 0.95: 1 -0.65,-0.95; 2 0,-0.95; 3 0.65,-0.95; 4 0.65,0.95; 5 -0.65,0.95
KC2016Z = smd 0.6 x 0.8: #1 -0.9,-0.6; #2 0.9,-0.6; #3 0.9,0.6; #4 -0.9,0.6

### Placement (x,y rotation side)
C1  11.4,39.27 180 top
C2  12.6,36.07 90 bottom
C3  9.27,39.94 0 bottom
C4  2.7,53.25 90 bottom
C5  38.06,51.07 90 bottom
C6  39.85,55.56 0 bottom
C7  40.73,56.73 180 bottom
C8  40.62,50.44 180 bottom
C9  9.24,43.93 180 bottom
C10  15,37.6 180 top
C11  2.7,58.55 90 bottom
C12  13.55,18.7 0 bottom
C13  13.85,13.2 0 bottom
C14  15.1,34.2 180 top
C15  30.4,18.1 90 bottom
C16  13.8,14.6 0 bottom
C17  16.58,20.53 0 bottom
C18  16.04,22.02 0 bottom
C19  13.28,25.83 180 bottom
C20  30.4,15.8 90 bottom
C22  13.3,27.95 0 bottom
D1  16.4,15.8 90 bottom
D2  42.52,49.25 90 bottom
D3  31.2,16.1 270 top
D4  42.5,17.3 180 bottom
EXT1  60.1,15.2 0 top
EXT2  64.5,2 0 top
GP12  41.1,3.3 0 top
GP13  50.9,3.3 0 top
GPIO40  31.2,8.6 0 top
I2C  34.15,61.85 0 bottom
IC1  40.6,53.1 0 bottom
IC2  6.5,35.7 0 bottom
LED1  11.24,37.16 0 top
Q3  17.1,53.9 270 bottom
Q4  22.16,60.85 0 bottom
Q5  25.4,60.85 0 bottom
R1  7.45,36.03 90 top
R2  16.9,42.3 180 bottom
R3  7.35,40.96 270 bottom
R4  16.8,43.7 180 bottom
R5  30.2,50.9 90 bottom
R6  5,51.3 180 bottom
R7  5.5,37.1 90 top
R8  2.85,47.95 270 bottom
R9  24.7,20.7 270 top
R10  18.6,36 180 top
R11  10.4,48.1 90 bottom
R12  16.35,48.22 90 bottom
R13  13.8,16.15 180 bottom
R14  18.6,37.5 180 top
R15  17.88,56.52 180 bottom
R16  17.83,60.47 180 bottom
R17  21.4,21.1 270 bottom
R18  71,17.5 0 bottom
R19  13.23,23.03 0 bottom
R20  28.23,47.92 270 bottom
R21  38.28,47.57 270 bottom
R22  35.28,3.52 0 bottom
R23  33.83,5.05 180 bottom
R24  19.7,54.4 270 bottom
R25  13.3,20 0 bottom
R26  14.54,53.96 90 bottom
R27  21.3,63.4 180 bottom
R28  47.8,16.9 0 bottom
R29  24.71,63.31 180 bottom
R30  49.9,14.8 180 bottom
R31  13.28,21.58 0 bottom
R32  25.4,58.55 0 bottom
R33  22.2,58.55 0 bottom
R34  25.71,56.67 90 bottom
R35  23.01,56.65 90 bottom
R36  16.7,26.75 0 bottom
R37  16.25,24.25 270 bottom
R38  70.9,14.9 0 bottom
R39  36.5,6.2 0 top
R40  39.2,6.2 0 top
R41  66.3,14.6 0 bottom
R42  63.7,14.6 180 bottom
R43  42.1,4.9 180 bottom
R44  51.8,5 180 bottom
RCPWR  ORANGE  [0603']  5.3,40.4 270 top
SPI-LED  14.7,9.95 180 bottom
U1  7.6,53.35 0 bottom
U2  42.4,42.9 180 top
U3  10,58.5 270 bottom
U4  34.8,16.3 90 bottom
U7  11,20.5 270 top
U$1  23.1,43.5 0 top
U$2  [LOGO_FABO_L]  41.7,13.25 0 top
U$3  34.9,54.9 180 bottom
U$5  [LOGO_SILK_GND]  16.6,55.3 90 top
U$6  [LOGO_SILK_GND]  24.2,55.3 90 top
U$7  [LOGO_SILK_GND]  34.3,55.3 90 top
U$8  [LOGO_SILK_GND]  44.6,55.3 90 top
U$9  15,35.8 90 top
U$10  15,39.3 90 top
U$11  9.23,41.86 270 bottom
U$12  [LOGO_SILK_GND]  8.9,55.3 90 top

### Tracks (layer width: path | path; a pad name or v marks a point on that pad's centre or on a via)
3.3VL
  Bottom 0.406: 29.3,16.9 27.9,18.3 22.1,18.3 21.4,19 R17.2
  Bottom 0.508: 29.3,16.9 29.85,16.35 C20.2 30.45,16.3 U4.2
3V3_JETSON  (via drill 0.35)
  Top 0.152: GPIO40.1 30.8,8.2 30.8,6.4 32.15,5.05 34.55,5.05 R39.1 36.7,5.2 37.7,5.2 38,4.9 39.9,4.9 v40.1,4.7 41.5,4.7 43.2,6.4 45.4,6.4 46.1,5.7 47.1,5.7 47.9,6.5 50.5,6.5 51.52,7.52 GPIO40.17 | v13.3,33.8 13.3,33.2 17.8,28.7 17.8,15.4 21,12.2 21,11 20.4,10.4 19.1,10.4 18.3,9.6 18.3,6.8 19.8,5.3
  Top 0.254: GPIO40.1 27.9,5.3 19.8,5.3 10,5.3 6.6,8.7 6.6,22.8 v8.3,24.5 v8.3,25.9 8.2,26 v7,26 4,29 3.2,29 1.6,30.6 1.6,54.8 v2.2,55.4 2.3,55.5 2.3,60.4 3.95,62.05 v4,62
  Bottom 0.152: U3.8 3.31,60.41 2.7,59.8 C11.2 | 4.33,54.02 U1.4 2.77,53.99 | R22.2 34.48,4.9 R23.2 34.63,7.13 35,7.5 35,9.2 34.3,9.9 32.5,9.9 GPIO40.1 | U$11.#4 U$11.#1 | C9.2 9.83,43.89 U$11.#1 | 2.77,53.99 C4.2 | IC2.28 10.65,37.65 11.43,36.87 C2.2 13.63,36.87 14.05,36.45 | v8.3,25.9 8.71,25.5 U7.25 | v8.3,24.5 8.81,24 U7.22 13.81,24 14.03,23.77 R19.1 14.17,22.9 14.7,22.9 15.24,22.36 C18.2 | v2.2,55.4 2.77,54.84 2.77,53.99 | v13.3,33.8 14.1,34.6 14.1,36.4 14.05,36.45 | U$11.#1 12.74,42.76 14.2,41.3 14.2,36.6 14.05,36.45 | R37.2 15.24,22.24 C18.2 | C17.2 15.24,21.07 C18.2 | R25.1 14.63,20.53 C17.2 | D1.CATHODE 15.78,19.57 C17.2 | R43.1 41.1,4.7 v40.1,4.7 | GPIO40.17 51.12,8.2 51.12,5.62 51,5.5 R44.1 51.1,4.9 51.1,4.12 GP13.3V3
  Bottom 0.254: U3.8 4.7,61.3 v4,62 v5.9,62
  pour Bottom (no thermals): 6.5,25.2 6.5,26.8 6.7,27 8.9,27 9.5,26.4 9.5,25.8 9.7,25.6 10.1,25.6 10.1,25.4 9.5,25.4 9.5,24.3 9.7,24.1 9.6,24 9.5,24 9.4,23.9 7.8,23.9
  pour Bottom (no thermals): 2.3,59.1 2.3,61.2 3.8,62.7 6.2,62.7 6.4,62.5 6.4,61.3 5.8,60.7 5.8,60.3 5.4,59.9 3.2,59.9 3.1,59.8 3.1,59 2.4,59
  pour Top (no thermals): 3.2,61.1 3.2,62.5 3.4,62.7 3.7,63 5.7,63 6,63 6.4,62.6 6.5,62.5 6.5,61.4 6,60.9 5.6,60.9 3.4,60.9
  pour Top (no thermals): 1.5,54.4 1.5,56.6 1.8,56.9 2.1,57.2 2.3,57.2 2.8,56.7 2.8,55.8 2.8,54.8 2.3,54.3 1.6,54.3
  pour Top (no thermals): 6.3,24.8 6.3,26.5 6.7,26.9 8.8,26.9 9.4,26.3 9.4,24.4 8.9,23.9 7.2,23.9
3VLL
  Top 1.27: U2.P$12 U2.P$26
  Bottom 0.406: R17.1 21.6,22.3 21.6,28.11 U2.P$26
5V_JETSON  (via drill 0.35)
  Top 0.152: LED1.VCC 10.6,38.12 C1.2 10.6,39.47 12.23,41.1 16.2,41.1 18.1,39.2 v18.6,39.2 | U$10.5 14.05,38 C10.2 15,37.05 15,35.6 14.55,35.15 14.2,35.15 | 14.2,35.15 U$9.5 | 14.2,35.15 14.2,34.55 C14.2 14.55,33.25 16.4,31.4 v18.9,31.4
  Top 0.508: D3.A 31.3,14.95 32.05,14.95 32.7,15.6 35.4,15.6 35.8,15.2 35.8,13.7 35,12.9 32.96,12.9 GPIO40.2
  Bottom 0.152: v18.6,39.2 18.7,39.2 18.7,39 | v18.9,31.4 19.5,31.4 20.4,30.5
  Bottom 0.406: R28.2 46.8,17.3 46.8,18 47.4,18.6 55.7,18.6 56.1,18.2 EXT1.2
  Bottom 0.508: 19.7,38 19.7,45.7 21.4,47.4 23.2,47.4 26.4,50.6 26.4,54.6 30.1,58.3 33.9,58.3 35.15,59.55 I2C.5V | 19.7,38 20.4,37.3 20.4,30.5 20.4,26.4 18.8,24.8 18.8,14.8 22.8,10.8 22.8,7.4 24.2,6 27.9,6 | 19.7,38 18.7,39 | GPIO40.2 31.4,11.14 | SPI-LED.5V 13.7,2.9 15,1.6 24.9,1.6 | GPIO40.2 30.44,11.14 29.7,10.4 29.7,7.8 27.9,6 | 46.8,17.3 D4.2 44.3,17.14 44.3,15.3 43.3,14.3 40,14.3 38.6,12.9 32.96,12.9 GPIO40.2 | 24.9,1.6 31.1,1.6 31.8,0.9 40.4,0.9 | GP12.VCC 41.1,1.6 40.4,0.9 | 40.4,0.9 48.2,0.9 49.5,0.9 | 49.5,0.9 59.6,0.9 60.5,1.8 EXT2.2 | 27.9,6 24.9,3 24.9,1.6 | GP13.5V 49.9,1.3 49.5,0.9
5VL_JETSON
  Top 0.305: R9.2 24.9,19.7
  Top 0.508: D3.K 30.5,17.45 29,17.45 28.05,18.4 25.2,18.4 24.7,18.9 R9.2
AI_CH1_ST  (via drill 0.35)
  Top 0.152: v24.5,50.4 31.1,50.4 33.16,48.34 36.25,48.34 36.8,48.9 36.8,49.8 v33.8,52.8
  Bottom 0.152: R2.2 18.2,42.3 18.8,42.9 18.8,47.5 19.5,48.2 22.3,48.2 v24.5,50.4 | v33.8,52.8 33.8,53 32.88,53.92 U$3.3
AI_CH2_TH  (via drill 0.35)
  Top 0.152: v26.9,49.5 19.8,49.5 v19.5,49.2
  Bottom 0.152: U$3.6 31.97,55.9 28.8,55.9 27.29,54.38 27.29,49.88 v26.9,49.5 | v19.5,49.2 19.3,49 18.4,49 18,48.6 18,44.1 R4.2
BEC_3V3  (via drill 0.35)
  Top 0.152: v39.2,53.1 40.1,52.2 42.2,52.2 v42.8,52.8
  Bottom 0.152: U$3.16 37.8,52.52 | 37.8,52.52 38.62,52.52 v39.2,53.1 | 41.4,56.86 C7.2 41.55,56.71 IC1.5 41.55,54.05 v42.8,52.8 | C5.2 37.8,52.13 37.8,52.52
BEC_60
  Bottom 0.152: C8.2 41.42,51.67 IC1.1 | C8.2 41.42,49.62 41.2,49.4 39.4,49.4 39,49.8 39,51.3 39.5,51.8 IC1.3 | C8.2 41.47,50.4 D2.C
BEC_62  (via drill 0.35)
  Top 0.152: U$1.2:VCC3 5.32,46.72 6.4,47.8 12.6,47.8 | 12.6,47.8 13,47.8 | 13,47.8 20.2,47.8 20.25,47.75 | 30.72,47.6 31.8,47.6 32,47.4 40.1,47.4 40.88,46.62 40.88,46.5 | 40.88,46.5 U$1.16:TH_VCC | 20.25,47.75 20.56,47.44 U$1.8:VCC1 | 40.88,46.5 41.28,46.9 v41.6,46.9 | v18.6,59 18.6,58.2 v19.7,57.1 | v12.2,53.6 12.6,53.2 12.6,48.2 13,47.8 | 30.72,47.6 30.72,47.78 30.5,48 20.5,48 20.25,47.75 | U$1.12:ST_VCC 30.72,47.6 | 12.6,47.8 12.94,47.46 U$1.5:VCC2
  Top 0.508: U$1.2:VCC3 5.32,41.22 RCPWR.ANODE
  Bottom 0.152: v41.6,46.9 42.52,47.81 D2.A | R16.2 18.6,60.45 v18.6,59 | v19.7,57.1 19.7,56.8 19.4,56.5 18.7,56.5 R15.2 18.68,56.18 18.2,55.7 12.56,55.7 U1.1 11.82,53.99 v12.2,53.6
  pour Top (no thermals): 4.8,46.8 4.8,40.9 5,40.7 5.6,40.7 5.8,40.9 5.8,46.2 6.9,47.3 12,47.3 12.3,47 12.3,42.1 12.5,41.9 13.2,41.9 13.4,42.1 13.4,45.3 13.2,45.5 13.2,46.8 14,47.6 19,47.6 19.9,46.7 19.9,42.1 20,42 21,42 21.1,42.1 21.1,45.9 22.7,47.5 28.9,47.5 30,46.4 30,42 30.2,41.8 31.5,41.8 31.8,42.1 31.8,45.9 32.6,46.7 35.6,46.7 35.8,46.9 36.4,46.9 36.6,47.1 38.7,47.1 39.6,46.2 39.6,42.6 40.4,41.8 41.4,41.8 41.5,41.9 41.5,45.9 42.4,46.8 42.4,47.6 41.9,48.1 41.5,48.1 41,47.6 40,47.6 39.7,47.9 32.2,47.9 31.1,49 27.5,49 27.3,48.8 20.1,48.8 19.9,48.6 15.7,48.6 15.5,48.4 6.4,48.4
CLK2  (via drill 0.35)
  Top 0.152: LED1.CKO 9.96,37.16 8.5,35.7 8.5,29.6 10.9,27.2 13.7,27.2 15.7,25.2 v15.7,12.3
  Bottom 0.152: SPI-LED.CI v15.7,12.3
CLK_HV
  Top 0.152: LED1.CKI 12.66,37.16 13.1,37.6 13.1,39.3 13.75,39.95 U$10.4
CLK_LV
  Top 0.152: R14.2 17.6,37.7 17.6,38.6 16.9,39.3 U$10.2
G18
  Bottom 0.152: R30.2 50.7,14.5 52.1,13.1 59.7,13.1 62.1,15.5 EXT1.5
G19  (via drill 0.35)
  Top 0.152: EXT1.4 60.1,14.8 61.5,13.4 62.1,13.4 62.4,13.7 62.4,14 62.6,14.2 63.4,14.2 63.7,13.9 63.7,13.2 64.1,12.8 65.1,12.8 65.4,13.1 65.4,13.6 65.8,14 66.4,14 66.8,13.6 66.8,13 67.1,12.7 67.6,12.7 68.3,13.4 68.3,14.3 68.8,14.8 v69,14.8
  Bottom 0.152: R38.2 70,14.8 v69,14.8
G21
  Bottom 0.152: R18.2 70,17.3 69.3,17.3 68.1,16.1 66.47,16.1 EXT1.7 66.1,15.6 R41.1
GND  (via drill 0.35)
  Top 0.152: LED1.GND 12.04,39.11 C1.1 12.2,39.55 v12.9,40.25 13.25,40.6 14.9,40.6 15.55,39.95 U$10.3 15.15,39.95 14.9,39.7 14.9,38.9 15.15,38.65 U$10.1 15.95,38 | v33.3,46 33.3,43.54 | 33.3,43.54 U$1.13:ST_GND | GPIO40.9 42.56,9.8 45.2,9.8 46.44,11.04 46.44,11.1 | 46.44,11.1 GPIO40.14 46.44,12.56 46.1,12.9 44.7,12.9 44.3,13.3 v44.3,13.8 44.3,14.7 44.25,14.75 | GPIO40.25 62.98,9.9 65.6,9.9 66.76,11.06 GPIO40.30 | 71.84,10.54 GPIO40.34 70.6,9.9 70.6,7.14 v69.66,6.2 | R1.1 7.22,35 | R7.1 6.58,35.23 R1.1 | R1.1 7.45,32.24 v6.4,31.2 | v7.7,54.5 v7.7,50.9 7.7,50.8 v9.2,49.3 | v9,46 7.9,44.9 7.86,44.9 U$1.3:GND3 | v35.4,64.5 34.5,64.5 29.5,59.5 v28.6,59.5 28.6,58.8 v30.5,56.9 | v40.6,48.3 41.5,49.2 v43.2,49.2 43.2,47.8 v44.3,46.7 | v44.3,46.7 44.3,44.38 U$1.17:TH_GND | 15.95,38 15.63,37.68 | 15.63,37.68 C10.1 | U$9.3 15.95,37.35 15.63,37.68 | v16.6,37.5 16.1,38 15.95,38 | U$1.9:GND1 23.1,42.1 | U2.P$27 21.8,28.87 v21.8,31.1 19.8,33.1 17,33.1 v16.6,33.5 15.9,34.2 C14.1 15.95,34.5 U$9.1 16.6,34.5 18,34.5 v18.2,34.3 | U2.P$27 23.1,27.32 19.68,27.32 v19.2,27.8 | U2.P$27 22.13,26.1 20.8,26.1 20.2,25.5 v20.2,23.6 20.2,22.8 19.5,22.1 19.5,19.7 v20.2,19 20.2,18.7 v21.3,17.6 | 29.5,41.4 30,40.9 32.8,40.9 33.3,41.4 33.3,43.54 | 29.5,41.4 29.5,46.2 28.5,47.2 23.1,47.2 21.6,45.7 21.6,41.91 21.18,41.49 19.65,41.49 19.3,41.83 19.3,45.7 18,47 16.5,47 15.48,45.98 U$1.6:GND2 14.3,44.68 v14.3,45.1 | 11.5,31.7 v11.4,31.7 11,31.7 10,32.7 10,34.8 10.7,35.5 v11,35.5 | v15.2,50.8 v13.4,50.8 v13.4,49 v15,49 | 29.5,41.4 29.5,41.3 26.9,38.7 22.1,38.7 21.3,39.5 v21.3,40.1 23.1,41.9 U$1.9:GND1 | v2.9,36.9 2.9,35.7 v2.6,35.4
  Top 0.152: v23.6,61.6 21.2,64 v19,64 | v9,20.4 12.01,17.4 v12.8,17.4 | v57.7,14.4 57.75,14.35 56.5,13.1 56.02,13.1 GPIO40.20 | v58.7,18.4 51.9,18.4 v50.9,17.4 | v11.6,46.7 v11.6,45.2 | v7.9,45.8 7.4,46.3 v7.4,46.7 | U$1.9:GND1 23.1,42.6 24.4,41.3 27.3,41.3 v27.5,41.1 | v40,60.5 41.3,61.8 v42.2,61.8 | v6.13,23.74 4.97,23.74 v3.86,24.85 | v10.6,58.8 10.6,59 v12,60.4 | v22.2,6.3 22.2,9.6 v21.5,10.3 21.5,11.2 v22.8,12.5 | v23.8,4.4 28.6,4.4 v29,4.8 30,5.8 v30.3,5.8 | v77.76,1.6 77.76,1.8 78.3,2.34 v78.3,4.34 v80.84,1.8 v83.38,4.34 85.48,2.24 v85.58,2.24 | v38.9,30.6 39.1,30.8 v39.1,33.1 38.9,33.3 v38.9,35.9 38.4,36.4 v38.4,38.5 | v33.4,38.4 34.9,36.9 35.8,36.9 36.9,35.8 36.9,32.9 v36.8,32.8 | v18.6,29.7 18.2,29.7 v17.3,30.6 | v36.4,24.7 36.4,28.8 v36.9,29.3 | v39.2,26.1 38.9,26.4 v38.9,28.4 | v10.9,29.3 11.1,29.5 v13.3,29.5 | v21.3,17.6 21.6,17.3 v21.6,15.9 21.6,15.3 v20.8,14.5 20.8,14.6 21.2,14.2 v22.4,14.2 22.4,12.9 v22.8,12.5 | v21.3,17.6 22.4,17.6 v22.9,17.1 23,17.2 v23,19.5 v23,21.1 | v20,16.6 21,17.6 v21.3,17.6 | v43.3,46 44,46.7 v44.3,46.7 | v29.7,12.2 29.5,12.4 24.7,12.4 24.5,12.2 23.1,12.2 v22.8,12.5 | R40.2 40.9,6.2 41.7,7 41.7,8.26 GPIO40.9 | v70.1,13.34 71.6,14.84 v72.9,14.84 | v76.5,14.44 77.1,15.04 77.1,15.9 77.74,16.54 v78.7,16.54 | v49.9,13.2 51,13.2 v52.1,14.3 | v19.9,11.5 19,12.4 v19,13 | v42.3,15.7 43.3,15.7 44.25,14.75 | v39.6,15.2 37.7,15.2 v35.5,17.4 | v34.9,14.3 34.7,14.1 v33.6,14.1 | v63.46,2.04 63.22,1.8 59.1,1.8 58.5,2.4 EXT2.1 | v45.24,7.24 45.2,7.2 42.5,7.2 41.36,8.34 GPIO40.9 | v50.26,7.34 50.26,9.34 49.7,9.9 47.64,9.9 46.44,11.1 | v74.96,5.2 76.56,5.2 v78.16,6.8 79.46,8.1 GPIO40.39 81.16,6.9 v81.16,6.7
  Top 0.152: v31.8,6.6 31.9,6.7 v33.8,6.7 | v33.2,3.3 34.8,3.3 v36,2.1 37.54,3.64 v37.54,4.04 | v45.5,16.1 44.25,14.85 44.25,14.75 | GP12.GND 39.1,2.2 37.7,0.8 15.2,0.8 v12.3,3.7 14.3,3.7 15.1,4.5 16.1,4.5 17.5,3.1 28.6,3.1 29.2,2.5 v30,2.5 | v44.44,1.84 44.44,2.44 v45.34,3.34
  Top 1.27: U2.P$13 23.1,27.32
  Bottom 0.152: 39.94,56.71 C7.1 | C7.1 40.64,56.01 C6.1 40.6,55.51 IC1.2 40.6,51.22 C8.1 | R5.1 33.3,47 v33.3,46 | R32.2 24.45,58.7 Q5.S | U3.5 4.61,56.5 3.3,56.5 2.7,57.1 C11.1 1.95,57.75 1.6,58.1 1.6,62.1 v1.7,62.2 | v12.9,40.25 12.59,39.94 C3.1 U$11.#2 9.83,41.27 9.34,41.76 R3.1 7.35,43.55 7.45,43.65 | IC2.5 8.05,31.65 8.2,31.5 | 8.2,31.5 8.7,31.5 | 8.7,31.5 9.3,31.5 | 9.3,31.5 9.9,31.5 | 9.9,31.5 10.4,31.5 10.65,31.75 | 10.65,31.75 IC2.1 | IC2.2 10,31.6 9.9,31.5 | IC2.3 9.35,31.55 9.3,31.5 | IC2.4 8.7,31.5 | 7.45,43.65 7.73,43.93 C9.1 8.69,45.69 8.9,45.9 | 8.2,31.5 6.7,31.5 v6.4,31.2 6.3,31.3 v2.6,31.3 2.2,31.7 IC2.14 2.2,33.57 2.4,33.77 2.4,35.2 v2.6,35.4 | U4.1 32.3,14 | C4.1 2.7,50.7 3,50.4 4.9,50.4 R6.2 6.2,50.9 v7.7,50.9 | v7.7,54.5 5.61,56.6 U3.5 | 8.9,45.9 v9,46 8.3,46.7 v7.4,46.7 7.3,46.8 v7.3,49 7.6,49.3 v9.2,49.3 | Q5.S 24.45,60.15 23.9,60.7 23.8,60.7 | 21.3,60.3 21.21,60.2 Q4.S 21.4,59.5 R33.2 21.4,56.5 v21.3,56.4 21.3,54.8 20.1,53.6 R24.2 18.9,53.6 Q3.S 16.6,51.3 15.7,51.3 v15.2,50.8 | 21.3,60.3 21.7,60.7 23.8,60.7 | U$3.15 36.83,53.27 36.3,53.8 36.3,55.9 35.03,57.17 U$3.8 30.77,57.17 v30.5,56.9 | C7.1 39.78,56.88 | 39.78,56.88 39.1,57.56 39.1,58.6 | 37.25,61.75 39.1,59.9 39.1,58.6 | 37.25,61.75 I2C.GND 40.05,61.85 43.7,58.2 43.7,49.7 v43.2,49.2 | Q5.S 25.55,60.8 27.3,60.8 v28.6,59.5 29.1,60 v29.1,61 | 37.25,61.75 37.25,63.45 36.2,64.5 v35.4,64.5 34.4,65.5 v34.4,66.1 | C5.1 38.06,49.84 39.4,48.5 40.4,48.5 v40.6,48.3 | C2.1 11.23,35.27 v11,35.5 | 10.65,31.75 11.4,31.75 v11.4,31.7 11.45,31.65 | v16.6,33.5 16.55,33.45 | 16.55,33.45 14.2,31.1 12,31.1 11.45,31.65 | v19.2,27.8 18.15,26.75 R36.1
  Bottom 0.152: GPIO40.14 46.44,13.74 48.2,15.5 48.2,16.3 R28.1 50.4,16.9 v50.9,17.4 52.15,16.15 52.15,14.35 | v14.3,45.1 13.9,45.5 13.9,46.5 v14,46.6 14.3,46.9 v15.2,46.9 15.2,48.8 v15,49 | IC2.24 8.05,37.85 7.4,37.2 3.1,37.2 2.9,37 v2.9,36.9 | 23.8,60.7 23.6,60.9 v23.6,61.6 | C18.1 16.93,21.93 | 16.93,21.93 17.38,21.48 17.38,20.6 | 17.38,20.6 C17.1 | C16.1 R13.2 14.5,16.15 13.26,17.4 v12.8,17.4 12.2,17.4 | C16.1 14.6,13.25 C13.1 | 9.5,16.9 9.5,16.6 9.61,16.5 U7.7 12,16.5 12.05,16.55 | 9.5,16.9 9.5,17.4 | 9.5,17.4 9.5,17.9 9.6,18 U7.10 12,18 12.2,17.8 12.2,17.5 | 9.5,17.4 9.6,17.5 U7.9 12.2,17.5 | 9.5,16.9 10.68,16.9 U7.8 12.1,17 12.2,17.1 | 12.2,17.5 12.2,17.4 | 12.2,17.4 12.2,17.1 | 12.2,17.1 12.2,16.7 12.05,16.55 | C12.1 14.7,18.7 15.8,17.6 17.3,17.6 17.9,18.2 | 17.9,18.2 17.9,20.08 17.38,20.6 | C16.1 17.5,14.6 17.55,14.65 | 17.55,14.65 17.9,15 17.9,18.2 | R36.1 17.7,22.7 16.93,21.93 | 11.7,11.2 SPI-LED.GND 11.7,7.3 v12,7 12,4 v12.3,3.7 11.2,2.6 v10.93,2.6 12.03,1.5 v12.73,1.5 | 11.7,11.2 11.7,11.6 12.4,12.3 14.3,12.3 14.65,12.65 C13.1 | 9.45,14.35 9.4,14.4 9.4,15.7 9.7,16 U7.6 11.8,16 12.05,16.25 12.05,16.55 | 9.45,14.35 9.81,14 U7.2 | U7.14 9.61,20 9.5,20.1 9.5,20.3 9.55,20.35 | 9.55,20.35 9.7,20.5 U7.15 | 9.55,20.35 9.05,20.35 | 9.05,20.35 v9,20.4 | U7.23 12.5,24.5 12.8,24.8 14.6,24.8 15,25.2 15,27.7 15.5,28.2 17.2,28.2 17.7,27.7 R36.1 | GPIO40.9 41.36,6.86 40.2,5.7 | v16.6,37.5 v16.6,33.5 | v18.2,34.3 17.35,33.45 16.55,33.45 | 9.05,20.35 8.7,20 7.9,20 7.6,20.3 7.6,21.5 8.9,22.8 9.2,22.8 9.45,22.55 | 9.51,22.5 U7.19 | 9.45,22.55 9.51,22.5 | U7.18 9.71,22 9.51,22.2 9.51,22.5 | 9.45,22.55 9.45,23.25 9.7,23.5 U7.21
  Bottom 0.152: v57.7,14.4 56.17,14.4 EXT1.1 54.1,16.3 52.15,14.35 | 52.15,14.35 v52.1,14.3 | GPIO40.34 73.08,9.9 78.16,9.9 GPIO40.39 | v14.2,43.2 12.5,43.2 11.6,44.1 v11.6,45.2 9.6,45.2 8.9,45.9 | v21.8,31.1 21.8,36 v21.9,36.1 21.9,36.5 21.4,37 21.4,37.6 21.5,37.7 21.5,38 v21,38.5 21,39.8 v21.3,40.1 | v27.5,41.1 29.1,39.5 v29.8,39.5 31.7,37.6 v31.8,37.6 | v31.8,37.6 31.8,37.5 v29.8,35.5 29.8,36 v28.2,37.6 | v16,70.8 v19,67.8 | v19,67.8 21.8,70.6 v21.8,70.7 24.3,68.2 v24.3,67.7 | v24.3,67.7 26.1,69.5 v26.6,69.5 27.9,70.8 v31.4,70.8 31.5,70.7 v31.5,67.6 | v31.5,67.6 33,69.1 v34.7,69.1 35.6,69.1 v37.2,67.5 37.2,70.1 v37.8,70.7 40.2,70.7 v42.1,68.8 43.6,67.3 v43.6,65.7 43.6,63.2 v42.2,61.8 | v31.5,64.9 v31.5,67.6 | v36.3,58.1 36.7,58.1 v37.7,59.1 38.6,59.1 39.1,58.6 | v40,60.5 v42,58.5 40.38,56.88 39.78,56.88 | v3.5,40 v2.5,41 1.3,42.2 1.3,44.4 1.7,44.8 2.1,44.8 3.25,43.65 7.45,43.65 | v3.86,27.39 v3.86,24.85 v3.86,22.31 v5.13,21.04 v3.86,19.77 v5.13,18.5 v3.86,17.23 v5.13,15.96 v3.86,14.69 v5.13,13.42 | U3.5 4.7,55.9 v4.1,55.3 | v6.9,58.5 7.9,59.5 v8.1,59.5 9.9,59.5 v10.6,58.8 | v12,60.4 10.7,61.7 v10.7,62.2 | v10.7,62.2 7.9,62.2 v7.8,62.3 | v10.7,62.2 11,62.5 14.4,62.5 15.8,63.9 v15.8,64.2 v17.5,65.9 19,67.4 v19,67.8 | v19,67.8 20.7,66.1 v21.5,66.1 | v24.3,67.7 26.2,65.8 v26.2,65.6 25.2,64.6 v24.6,64.6 | v5.13,5.8 v3.86,7.07 v2.59,8.34 v3.86,9.61 | v3.86,9.61 v5.13,10.88 v3.86,12.15 v5.13,13.42 | v3.86,9.61 v5.13,8.34 v6.4,7.07 | v5.13,13.42 5.73,14.02 v8.43,14.02 8.76,14.35 9.45,14.35 | v19.9,11.5 21.1,10.3 v21.5,10.3 | v22.2,6.3 22.6,5.9 22.6,5 23.2,4.4 v23.8,4.4 | v36.4,24.7 37.8,24.7 v39.2,26.1
  Bottom 0.152: v36.9,29.3 37.6,29.3 v38.9,30.6 36.8,32.7 v36.8,32.8 | v38.4,38.5 38.2,38.7 v38.2,40.3 | v33.3,40.4 33.4,40.3 v33.4,38.4 32.6,37.6 v31.8,37.6 | v31.8,37.6 33,36.4 v33,35.9 | v16.6,33.5 17.7,32.4 v18,32.4 17.3,31.7 v17.3,30.6 16.2,30.6 v15.5,29.9 15.1,29.5 v13.3,29.5 12.5,30.3 11.7,30.3 11.45,30.55 11.45,31.65 | v16.8,62 18.1,62 v18.7,62.6 18.7,63.7 v19,64 | v20.6,61.6 21.3,60.9 21.3,60.3 | v14.8,7.9 16.1,6.6 16.1,4.4 17.2,3.3 16.85,2.94 15.57,2.94 14.43,4.09 14.43,7.53 v14.8,7.9 | 29.5,3 v30,2.5 29,3.5 v29,4.8 | GPIO40.39 80.5,8.6 80.9,9 80.9,10.2 81.1,10.4 81.1,14.14 v78.7,16.54 80,16.54 v81.4,17.94 | C13.1 16.4,13.2 v16.6,13 | U4.1 31.6,13.6 31.1,13.6 v29.7,12.2 | 67.1,11.48 66.81,11.19 | 66.81,11.19 GPIO40.30 68.96,13.34 v70.1,13.34 | 66.81,11.19 66.81,11.59 66.1,12.3 65.6,12.3 64.45,13.45 64.45,14.55 R42.2 R41.2 | v72.9,14.84 76.1,14.84 v76.5,14.44 | v7.7,54.5 9,55.8 v9.9,55.8 | v7.7,54.5 v9,53.2 | v14.8,7.9 14.7,8 14.7,11.44 14.41,11.73 13,11.73 12.47,11.2 11.7,11.2 | v58.7,18.4 62.94,18.4 v63.2,18.14 | v23,21.1 23,22.6 v23.1,22.7 | v23.1,22.7 23.3,22.7 v26.5,19.5 | v26,22.7 v23.1,22.7 | v39.6,15.2 41.8,15.2 v42.3,15.7 42.4,15.8 v42.4,18.5 | 30.55,17.4 C15.1 33.75,17.55 v34,17.8 35.1,17.8 v35.5,17.4 34.7,16.6 v34,16.6 | v39.6,15.2 38.5,14.1 35.1,14.1 v34.9,14.3 | C20.1 30.4,14.3 v30,13.9 | U4.1 33.5,14 v33.6,14.1 | v39.5,17.1 39.6,17 v39.6,15.2 | v18,14.1 17.55,14.55 17.55,14.65 | EXT2.1 57.03,1.8 v55.44,1.8 | GPIO40.25 60.38,9.9 55.3,9.9 GPIO40.20 | v63.46,2.04 65.16,2.04 66.4,0.8 76.96,0.8 v77.76,1.6 | GPIO40.39 79.46,5.5 v78.3,4.34 | v50.26,7.34 50.2,7.29 50.2,5.1 49.8,4.7 48.5,4.7 47.9,4.1 GP13.GND 45.36,3.32 v45.34,3.34
  Bottom 0.152: v65.16,4.8 68.26,4.8 v69.66,6.2 | v69.36,1.7 71.96,1.7 v73.26,3 74.96,4.7 v74.96,5.2 | v37.54,4.04 38.36,4.04 GP12.GND | v30.3,5.8 31.1,6.6 v31.8,6.6
  Bottom 0.508: U4.1 31.4,14 30.4,15 C20.1
  pour Bottom (rank 6): -18.5,100.5 95.7,100.5 95.7,-1.5 -18.5,-1.5
  pour Top (rank 6): -18.7,101 96,101 96,-2.9 -18.7,-2.9
GPIO4  (via drill 0.35)
  Top 0.152: EXT1.3 56.43,14.8 52.9,14.8 51.4,16.3 50.2,16.3 49,15.1 46.6,15.1 v45.9,14.4 | R39.2 R40.1 38.4,8.18 GPIO40.7
  Bottom 0.152: v45.9,14.4 45.9,13.3 45.4,12.8 40.6,12.8 40.1,12.3 40.1,9.88 GPIO40.7
GPIO12  (via drill 0.35)
  Top 0.152: v48.7,1.8 54.4,1.8 57.1,4.5 61.5,4.5 v61.9,4.9 | v67.4,6.3 68,6.9 68,9.84 GPIO40.32
  Bottom 0.152: R43.2 42.9,3.5 GP12.I/O 44.1,3.3 45.8,1.6 48.5,1.6 v48.7,1.8 | v61.9,4.9 63.3,6.3 v67.4,6.3
GPIO13
  Bottom 0.152: GPIO40.33 71.84,8.04 71,7.2 69.6,7.2 69.2,6.8 68.3,6.8 67.9,7.2 63.1,7.2 62.4,6.5 60.7,6.5 60,7.2 58.2,7.2 57.5,6.5 56,6.5 55.7,6.8 53.2,6.8 52.6,6.2 R44.2 53,5 53.9,4.1 GP13.IO
GPIO18
  Bottom 0.152: GPIO40.12 43.9,10.8 44.8,9.9 47.2,9.9 47.7,10.4 47.7,13.4 R30.1
GPIO19  (via drill 0.35)
  Top 0.152: GPIO40.35 73.2,9.78 73.2,13.2 v73.1,13.3
  Bottom 0.152: v73.1,13.3 71.7,14.7 R38.1
GPIO20
  Top 0.152: EXT1.6 64.1,15.3 64.7,14.7 67.5,14.7 68.9,16.1 75.4,16.1 75.9,15.6 75.9,15.1 75.5,14.7 74,14.7 73.7,14.4 73.7,13.7 73.9,13.5 78.3,13.5 78.6,13.2 78.6,12.5 77.24,11.14 GPIO40.38
  Bottom 0.152: EXT1.6 63.5,15.87 63.5,15.6 62.9,15 R42.1
GPIO21  (via drill 0.35)
  Top 0.152: v75.3,17.3 79.8,17.3 80.2,16.9 80.2,16.2 79.8,15.8 78.2,15.8 77.9,15.5 77.9,14.8 78.25,14.45 80.15,14.45 80.6,14 80.6,13.5 79.5,12.4 79.5,11.18 GPIO40.40
  Bottom 0.152: v75.3,17.3 75.1,17.5 R18.1
GPIO23  (via drill 0.35)
  Top 0.152: EXT2.4 64.5,1.7 63.8,1 47.3,1 46.3,2 v46.3,4.7 46.3,4.6 | v47.7,7.5 v46.7,6.5
  Bottom 0.152: v46.3,4.7 46.3,6.1 v46.7,6.5 | v47.7,7.5 47.7,9.4 48.98,10.68 GPIO40.16
GPIO24  (via drill 0.35)
  Top 0.152: GPIO40.18 52.76,9.9 54.9,9.9 55.3,9.5 55.3,7.7 56,7 57.71,7 v58.4,6.31
  Bottom 0.152: EXT2.3 59.47,6.31 v58.4,6.31
GPIO25  (via drill 0.35)
  Top 0.152: EXT2.7 70.5,4.4 69.6,5.3 66.9,5.3 65.5,6.7 v65.5,7.76 | v61,12.8 60.4,12.2 60.4,10.2 60.1,9.9 57.1,9.9 56.6,10.4 GPIO40.22
  Bottom 0.152: v65.5,7.76 65.5,9.6 65.2,9.9 63.5,9.9 63,10.4 63,12.2 62.4,12.8 v61,12.8
GPIO26
  Top 0.152: EXT2.6 68.5,1.5 69.3,0.7 73.6,0.7 74.1,1.2 74.1,2.1 74.3,2.3 77.4,2.3 77.7,2.6 77.7,3.6 77.4,3.9 74.5,3.9 73.9,4.5 73.9,5.9 74.7,6.7 76.5,6.7 76.92,7.12 GPIO40.37
GPIO27  (via drill 0.35)
  Top 0.152: EXT2.5 66.5,4.6 65.35,5.75 56.15,5.75 55.4,6.5 51.8,6.5 50.9,5.6 v49.2,5.6
  Bottom 0.152: v49.2,5.6 48.7,5.6 46.44,7.86 GPIO40.13
LED0
  Bottom 0.152: IC2.6 7.4,33.6 7.8,34 10.8,34 12.7,32.1 14.1,32.1 15.4,33.4 15.4,39.5 16.1,40.2 R2.1
LED1
  Bottom 0.152: IC2.7 6.75,34.05 7.3,34.6 10.9,34.6 12.9,32.6 13.7,32.6 14.7,33.6 14.7,39.7 15.1,40.1 15.1,43.4 15.4,43.7 R4.1
MOSI1
  Top 0.152: R10.1 23,32.4 23.1,32.4 U2.P$25
  Top 1.27: U2.P$11 23.1,32.4
MOSI2  (via drill 0.35)
  Top 0.152: v17.8,12.3 17.8,13.2 16.7,14.3 16.7,27.55 13.77,30.48 11.22,30.48 9.3,32.4 9.3,35.2 10.44,36.34 LED1.SDO
  Bottom 0.152: SPI-LED.DI 17.7,12.2 v17.8,12.3
MOSI_HV
  Top 0.152: U$9.4 12.13,36.45 LED1.SDI
MOSI_LV
  Top 0.152: R10.2 17.45,35.65 17.3,35.8 U$9.2
N$3
  Bottom 0.152: C22.2 12.05,27.5 U7.29
N$5  (via drill 0.35)
  Top 0.152: v12.4,58.7 12.9,58.7 19.3,52.3 32.9,52.3 v35.9,49.3 | U2.P$1 38.72,24.78 37.8,25.7 37.8,36.4 36.2,38 v36.2,39.6
  Top 1.27: U2.P$1 U2.P$15
  Bottom 0.152: v35.9,49.3 35.9,39.9 v36.2,39.6 | v12.4,58.7 10.7,60.4 7.2,60.4 5.94,59.14 U3.7
N$6
  Bottom 0.152: U1.2 12.9,52.72 13.34,53.16 R26.1
N$7
  Bottom 0.152: IC2.23 7.35,38.67 R3.2
N$8  (via drill 0.35)
  Top 0.152: v11.7,57.5 18.1,51.1 32.5,51.1 v34.2,49.4
  Top 1.27: U2.P$2 U2.P$16
  Bottom 0.152: U2.P$2 37.48,27.32 35.8,29 35.8,33.9 34.2,35.5 v34.2,49.4 | U3.6 5.94,57.87 7,56.8 9.2,56.8 9.9,57.5 v11.7,57.5
N$9
  Bottom 0.152: R15.1 15.38,56.52 U3.4
N$10
  Bottom 0.152: 32,18.9 U4.3
  Bottom 0.305: C15.2 30.45,18.6
  Bottom 0.508: 30.45,18.6 U4.3 32.2,18.8 39.37,18.8 D4.1
N$12
  Bottom 0.152: R16.1 15.37,60.47 U3.1
N$14
  Bottom 0.152: R13.1 12.35,15.5 U7.5
N$16
  Bottom 0.152: U7.27 11.9,26.5 12.1,26.7 13.8,26.7 14.08,26.43 C19.2
N$17
  Bottom 0.152: U7.3 11.61,14.5 11.9,14.2 11.9,13.7 12.4,13.2 C13.2
N$18
  Bottom 0.152: U7.17 12.39,21.5 R31.2
N$21
  Bottom 0.152: C19.1 12.31,26 U7.26
N$22
  Bottom 0.152: U7.28 11.9,27 12,27.1 13.9,27.1 14.1,27.3 C22.1
N$23
  Bottom 0.152: R24.1 18.6,55.2 Q3.G 17.55,54.85 16.9,54.2 16.9,53 16,52.1 13.3,52.1 12.9,51.7 9.6,51.7 7.6,49.7 3.1,49.7 2.85,49.45 R8.1
N$24
  Top 0.152: RCPWR.CATHODE 5.3,38.1 R7.2
N$25
  Bottom 0.152: U7.4 11.71,15 12.1,14.6 C16.2
N$26
  Bottom 0.152: Q3.D 15.95,54.25 15.44,54.76 R26.2
N$27
  Bottom 0.152: 22.16,62.25 Q4.D 22.1,62.05 R27.2
N$28
  Bottom 0.152: U3.3 18.77,57.87 19.6,58.7 19.6,62.7 20.3,63.4 R27.1
N$29
  Bottom 0.152: Q5.D 25.4,63.2 R29.2
N$30
  Bottom 0.152: U3.2 13.57,59.14 12.9,59.8 12.9,61.2 13.7,62 15.4,62 17.4,64 17.4,64.4 18.3,65.3 22.7,65.3 23.91,64.09 R29.1
N$32
  Bottom 0.152: D1.ANODE 16.4,15.9 14.8,17.5 13.95,17.5 C12.2 12.75,19.75 R25.2 13.1,20.6 13.1,20.7 13.3,20.9 13.6,20.9 14.08,21.38 R31.1
N$33
  Bottom 0.152: R34.2 26.2,57.96 R32.1 26.35,58.7 Q5.G
N$37  (via drill 0.35)
  Top 0.152: v8.96,21.7 9,21.74 9,22.9 10.3,24.2 14.7,24.2 v14.9,24
  Bottom 0.152: R36.2 15.7,25.8 R37.1 16.15,25.25 v14.9,24 | U7.16 9.66,21 v8.96,21.7
N$38
  Bottom 0.152: Q4.G 23,59.6 R33.1 R35.2
N$40
  Bottom 0.152: IC1.4 39.04,55.01 C6.2
N$41  (via drill 0.35)
  Top 0.152: v8.7,37.1 8.43,36.83 R1.2
  Bottom 0.152: U$11.#3 8.72,40.87 C3.2 8.72,38.64 IC2.25 v8.7,37.1
N$50
  Bottom 0.152: R19.2 12.4,23 U7.20
NC5
  Top 1.27: U2.P$10 U2.P$24
PCH1  (via drill 0.35)
  Top 0.152: U$1.7:SIGNAL1 18.02,44.98 v17,46
  Bottom 0.152: v17,46 16.97,46 16.35,46.62 R12.1
PCH2  (via drill 0.35)
  Top 0.152: U$1.4:SIGNAL2 v10.4,46.1
  Bottom 0.152: R11.1 v10.4,46.1
PCH3_XAIO  (via drill 0.35)
  Top 0.152: v35.8,35.8 34.8,35.8 32.4,38.2 v32.4,39.7 | v24.3,45.7 22.5,45.7 22.1,45.3 22.1,41.7 21.4,41 21,41 20.3,40.3 18.2,40.3 17,41.51 11.41,41.51 9.7,39.8 9.7,38.5 9.4,38.2 7.3,38.2 6.5,39 6.5,45.5 v6.6,45.6 | v5.5,48.8 5.5,52.8 v5.8,53.1
  Top 1.27: U2.P$3 U2.P$17
  Bottom 0.152: R6.1 4.2,52.56 4.28,52.63 | 4.28,52.63 U1.3 | U2.P$3 35.8,35.19 v35.8,35.8 | v32.4,39.7 26.4,45.7 v24.3,45.7 | v6.6,45.6 5.5,46.7 v5.5,48.8 | v5.8,53.1 5.33,52.63 4.28,52.63
PCH_3  (via drill 0.35)
  Top 0.152: U$1.1:SIGNAL3 2.78,45.82 v2.7,45.9
  Bottom 0.152: v2.7,45.9 2.7,47 R8.2
RC_CH1_ST  (via drill 0.35)
  Top 0.152: U$1.11:ST_SIGNAL 28.18,45.98 v28.2,46
  Bottom 0.152: v28.2,46 28.2,47.1 R20.2
RC_CH2_TH  (via drill 0.35)
  Top 0.152: U$1.15:TH_SINGNAL 38.34,45.86 v38.3,45.9
  Bottom 0.152: v38.3,45.9 38.28,45.93 R21.2
RCH1
  Bottom 0.152: R20.1 28.23,52.53 30.3,54.6 31.97,54.6 U$3.4
RCH2
  Bottom 0.152: R21.1 38.28,48.62 36.3,50.59 36.3,52.9 35.8,53.4 35.8,55.4 34.68,56.52 U$3.7
RECV_CH1  (via drill 0.35)
  Top 0.152: v30.2,53.3 30.1,53.2 25.2,53.2 v25.1,53.3 | v24.3,55.1 24.3,55 v22.7,53.4
  Bottom 0.152: v25.1,53.3 22.8,53.3 v22.7,53.4 22,53.4 18.7,50.1 16.9,50.1 16.35,49.55 R12.2 | v30.2,53.3 30.3,53.2 31.93,53.2 U$3.2 | R34.1 25.07,55.87 v24.3,55.1
RECV_CH2  (via drill 0.35)
  Top 0.152: v28.4,54.2 26.3,54.2 25.9,54.6 25.9,56.3 25.1,57.1 24.5,57.1 v24.2,56.8
  Bottom 0.152: R11.2 10.4,50 11.12,50.72 12.08,50.72 12.9,49.9 15.6,49.9 16.42,50.72 18.48,50.72 23.01,55.25 R35.1 23.35,55.85 24.2,56.7 v24.2,56.8 | U$3.5 29.6,55.22 29.5,55.12 | 29.5,55.12 | 29.5,55.12 28.58,54.2 v28.4,54.2
SCK1
  Top 0.152: R14.1 23.33,37.5
  Top 1.27: U2.P$9 U2.P$23 23.33,37.5
SCL  (via drill 0.35)
  Top 0.152: v31.3,59.4 32.8,57.9 34.4,57.9 37.5,61 37.5,64.6 37.45,64.65 | 37.45,64.65 33.6,68.5 15.5,68.5 3.2,56.2 3.2,47.49 3.72,46.97 3.72,41.31 2.5,40.09 2.5,38.6 3.7,37.4 3.7,36.5 3.56,36.36 v3.56,34.3 3.6,34.26 v3.6,29.9 | v15.8,3.5 16.8,2.5 28.3,2.5 29.2,1.6 30.1,1.6 30.4,1.9 v32.6,1.9 | v7.8,18.1 7.4,17.7 7.4,13.6 8.1,12.9 9.2,12.9 13.2,8.9 13.2,7.4 14.4,6.2 15,6.2 v15.1,6.3 | v42.2,63.7 40.5,65.4 38.2,65.4 37.45,64.65
  Top 1.27: U2.P$6 U2.P$20
  Bottom 0.152: I2C.SCL 31.15,59.55 v31.3,59.4 | GPIO40.5 36.08,8.4 R22.1 36.02,3.52 34.4,1.9 v32.6,1.9 | IC2.26 9.35,36.26 8.9,35.81 5.06,35.81 v3.56,34.3 | v15.8,3.5 15.1,4.2 v15.1,6.3 | U7.13 9.2,19.5 v7.8,18.1 7,18.9 7,21.6 5.1,23.5 5.1,28.4 v3.6,29.9 | U2.P$6 39.82,37.48 39.6,37.7 39.6,41.8 42.3,44.5 42.3,45.8 42.2,45.9 42.2,46.2 44.8,48.79 44.8,58.01 41.4,61.4 41.4,62.4 42.2,63.2 v42.2,63.7
SDA  (via drill 0.35)
  Top 0.152: U2.P$5 40.93,34.94 | v34.8,54.1 34.8,54.6 33.3,56.1 30,56.1 26.4,59.7 26.4,63.9 28.6,66.1 | 28.6,66.1 v32.5,66.1 | v32,3.9 31.6,3.5 18.2,3.5 v17.7,4 | 28.6,66.1 27.8,66.9 17,66.9 4.38,54.28 4.38,35.2 v5.28,34.3 4.9,33.92 v4.9,29.8 | v16.8,7 8.7,15.1 v8.7,15.9 8.7,19.3 7.9,20.1 v7.9,23
  Top 1.27: U2.P$5 U2.P$19
  Bottom 0.152: v34.8,54.1 34.8,51.4 37.1,49.1 37.1,40.4 37.6,39.9 37.6,39.3 37.2,38.9 37.2,38.2 38.3,37.1 39,37.1 39.6,36.5 39.6,36.47 U2.P$5 | v32.5,66.1 33.15,65.45 I2C.SDA | GPIO40.3 32.73,7.59 32.73,5.35 R23.1 33.03,4.93 v32,3.9 | IC2.27 10,35.9 9.2,35.1 6.08,35.1 v5.28,34.3 | U7.12 11.81,19 11.9,18.9 11.9,18.6 11.8,18.5 U7.11 9.4,18.5 8.7,17.8 v8.7,15.9 | v17.7,4 16.8,4.9 v16.8,7 | v7.9,23 7.9,23.2 5.9,25.2 5.9,28.8 v4.9,29.8
SIGNAL_SELCET
  Top 1.27: U2.P$4 U2.P$18
  Bottom 0.152: R5.2 30.2,52 30.82,52.62 U$3.1 32.68,52.62 35.1,50.2 35.1,38.43 U2.P$4
XAIO_5V
  Top 0.508: R9.1 24.7,23.59 U2.P$14
  Top 1.27: U2.P$14 U2.P$28
XIAO_RX
  Top 1.27: U2.P$22 U2.P$8
XIAO_TX
  Top 1.27: U2.P$7 U2.P$21

### Text on the board
tPlace: ST | TH | ch | 3 | ch | 2 | ch | 1 | Not connect | Not connect | VCC | VCC | VCC | VCC | VCC | SIGNAL | SIGNAL | SIGNAL | SIGNAL | SIGNAL | D0 | 2 | 20 | 30 | 40 | 1 | 9 | 19 | 29 | 39 | Rev 3.0.3
bPlace: SCL | SDA | 5V | GND | Rev 3.0.3 | S/N | 3V3 | GND | 5V | 1 | MOSI | GND | CLK | F-612-3-0-3-A-N-J-2-PCB | 5V | 1 | 1 | 1
Document: Jetson Nano DevKit / B-01 (A02) | #612 JetRacer Rev 3.0.3 / 2024/02/20 / 2024/03/04 ANOTAION
_tNames: I2C-CON | Jetson Nano Border | TLP2270 | MC74VHC157 | TLP291 | LP2985-33DBVR | CUS05F40 | KC2016Z(25MHz,OSC) | Not Used | Not Used | PCA9685PW | XIAO ESP32S3 | AP102-202 | 0.96inchOLED(Blue) | Expansion / I2S Connector and e.t.c | Jetson Orin Nano / Users Hole | SPI-LED CON | Expansion / GPIO | Expansion / SPI Connector and e.t.c